# EAGLE schematic cft (EAGLE 5.11), part 2 of 7
## Sheet 12 of 49
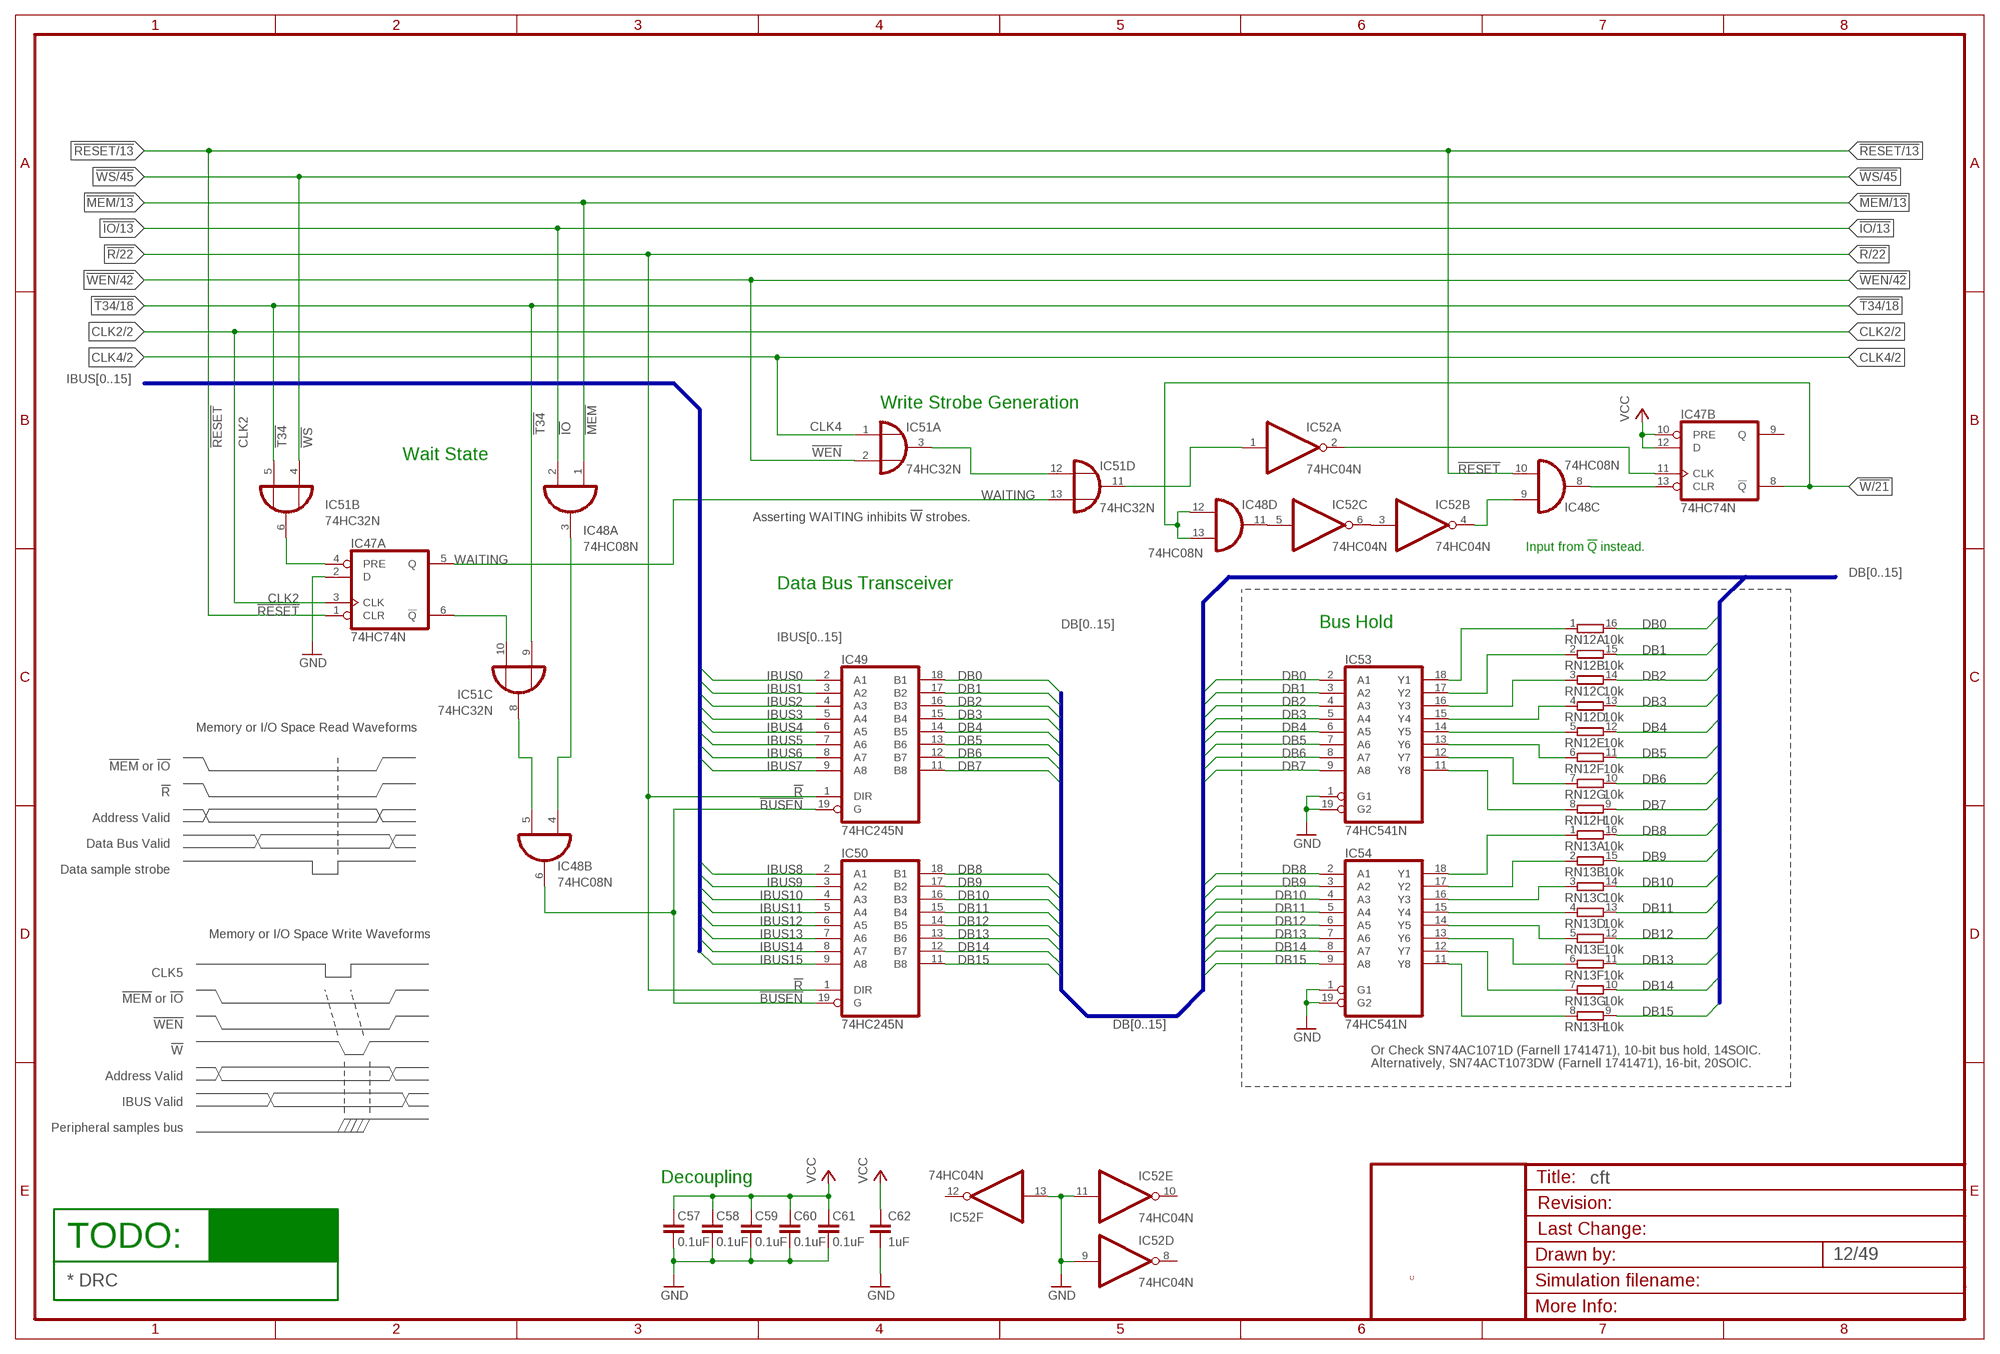
[diagram p11: schematic, sheet 12]

### Parts
C57  0.1uF  C-EU025-024X044  [C025-024X044]
C58  0.1uF  C-EU025-024X044  [C025-024X044]
C59  0.1uF  C-EU025-024X044  [C025-024X044]
C60  0.1uF  C-EU025-024X044  [C025-024X044]
C61  0.1uF  C-EU025-024X044  [C025-024X044]
C62  1uF  C-EU025-024X044  [C025-024X044]
IC47  74HC74N  [DIL14]
IC48  74HC08N  [DIL14]
IC49  74HC245N  [DIL20]
IC50  74HC245N  [DIL20]
IC51  74HC32N  [DIL14]
IC52  74HC04N  [DIL14]
IC53  74HC541N  [DIL20]
IC54  74HC541N  [DIL20]
RN12  10k  8R-N  [DIL16]
RN13  10k  8R-N  [DIL16]

### Nets
!BUSEN: IC48.6(B:O) IC49.19(G) IC50.19(G)
!EN0: IC48.3(A:O) IC48.4(B:I0)
!IO: IC48.2(A:I1) ; also sheet 4,5,6,13,42,44,45,46
!MEM: IC48.1(A:I0) ; also sheet 4,5,6,13,21,24,42,44,45,46
!R: IC49.1(DIR) IC50.1(DIR) ; also sheet 4,5,6,22,24,25,26,27,28,29,30,41,42,44,45,46,47,48
!RESET: IC47.1(A:CLR) IC48.10(C:I1) ; also sheet 2,3,4,7,8,10,11,13,14,17,18,19,20,21,22,25,26,28,29,30,31,44,45,46,47
!T34: IC51.5(B:I1) IC51.9(C:I0) ; also sheet 2,18,44,45,46
!W: IC47.8(B:!Q) IC48.12(D:I0) IC48.13(D:I1) ; also sheet 21,22,24,25,26,27,28,29,30,41,44,45,46,47,48
!WEN: IC51.2(A:I1) ; also sheet 4,5,6,42
!WS: IC51.4(B:I0) ; also sheet 4,44,45,46
CLK2: IC47.3(A:CLK) ; also sheet 2,44,45,46
CLK4: IC51.1(A:I0) ; also sheet 2,4,8,44,45,46
DB0: IC49.18(B1) IC53.2(A1) RN12.16 ; also sheet 21,22,24,25,26,27,28,29,30,31,41,44,45,46,47,48
DB1: IC49.17(B2) IC53.3(A2) RN12.15 ; also sheet 21,22,24,25,26,27,28,29,30,31,41,44,45,46,47,48
DB2: IC49.16(B3) IC53.4(A3) RN12.14 ; also sheet 21,22,24,25,26,27,28,29,30,31,41,44,45,46,47,48
DB3: IC49.15(B4) IC53.5(A4) RN12.13 ; also sheet 21,22,24,25,26,27,28,29,30,31,41,44,45,46,47,48
DB4: IC49.14(B5) IC53.6(A5) RN12.12 ; also sheet 21,22,24,25,26,27,28,29,30,31,41,44,45,46,47,48
DB5: IC49.13(B6) IC53.7(A6) RN12.11 ; also sheet 21,22,24,25,26,27,28,29,30,31,41,44,45,46,47,48
DB6: IC49.12(B7) IC53.8(A7) RN12.10 ; also sheet 21,22,24,25,26,27,28,29,30,31,41,44,45,46,47,48
DB7: IC49.11(B8) IC53.9(A8) RN12.9 ; also sheet 21,22,24,25,26,27,28,29,30,31,41,44,45,46,47,48
DB8: IC50.18(B1) IC54.2(A1) RN13.16 ; also sheet 21,24,26,27,29,30,31,41,44,45,46,48
DB9: IC50.17(B2) IC54.3(A2) RN13.15 ; also sheet 24,26,27,29,30,41,44,45,46,48
DB10: IC50.16(B3) IC54.4(A3) RN13.14 ; also sheet 24,26,27,29,30,41,44,45,46,48
DB11: IC50.15(B4) IC54.5(A4) RN13.13 ; also sheet 24,26,27,29,30,41,44,45,46,48
DB12: IC50.14(B5) IC54.6(A5) RN13.12 ; also sheet 24,26,27,29,30,41,44,45,46,48
DB13: IC50.13(B6) IC54.7(A6) RN13.11 ; also sheet 24,26,27,29,30,41,44,45,46,48
DB14: IC50.12(B7) IC54.8(A7) RN13.10 ; also sheet 24,26,27,29,30,41,44,45,46,48
DB15: IC50.11(B8) IC54.9(A8) RN13.9 ; also sheet 24,26,27,29,30,41,44,45,46,48
GND [low power]: C57.1 C58.1 C59.1 C60.1 C61.1 C62.2 IC47.2(A:D) IC52.9(D:I) IC52.11(E:I) IC52.13(F:I) IC53.1(G1) IC53.19(G2) IC54.1(G1) IC54.19(G2) ; also sheet 2,3,4,5,6,7,8,9,10,11,13,14,15,16,17,18,19,20,21,22,24,25,26,27,28,29,30,31,32,33,34,35,36,37,38,39,40,41,42,43,44,45,46,47,48,49
IBUS0: IC49.2(A1) ; also sheet 3,6,9,10,13,14,15,16,18,20
IBUS1: IC49.3(A2) ; also sheet 3,6,9,10,13,14,15,16,18,20
IBUS2: IC49.4(A3) ; also sheet 3,6,9,10,13,14,15,16,18,20
IBUS3: IC49.5(A4) ; also sheet 3,6,9,10,13,14,15,16,18,20
IBUS4: IC49.6(A5) ; also sheet 3,6,9,10,13,14,15,16,18,20
IBUS5: IC49.7(A6) ; also sheet 3,6,9,10,13,14,15,16,18,20
IBUS6: IC49.8(A7) ; also sheet 3,6,9,10,13,14,15,16,18,20
IBUS7: IC49.9(A8) ; also sheet 3,6,9,10,13,14,15,16,18,20
IBUS8: IC50.2(A1) ; also sheet 3,6,9,10,13,14,15,16,18,20
IBUS9: IC50.3(A2) ; also sheet 3,6,9,10,13,14,15,16,18,20
IBUS10: IC50.4(A3) ; also sheet 3,6,9,10,13,14,15,16,18,20
IBUS11: IC50.5(A4) ; also sheet 3,6,9,10,13,14,15,16,18,20
IBUS12: IC50.6(A5) ; also sheet 3,6,9,10,13,14,15,16,18,20
IBUS13: IC50.7(A6) ; also sheet 3,6,9,10,13,14,15,16,18,20
IBUS14: IC50.8(A7) ; also sheet 3,6,9,10,13,14,15,16,18,20
IBUS15: IC50.9(A8) ; also sheet 3,6,9,10,13,14,15,16,18,20
N$17: IC47.6(A:!Q) IC51.10(C:I1)
N$18: IC48.5(B:I1) IC51.8(C:O)
N$19: IC47.4(A:PRE) IC51.6(B:O)
N$24: IC48.9(C:I0) IC52.4(B:O)
N$25: IC47.13(B:CLR) IC48.8(C:O)
N$26: IC47.11(B:CLK) IC52.2(A:O)
N$27: IC52.3(B:I) IC52.6(C:O)
N$28: IC48.11(D:O) IC52.5(C:I)
N$34: IC51.11(D:O) IC52.1(A:I)
N$382: IC51.3(A:O) IC51.12(D:I0)
N$715: IC53.15(Y4) RN12.4
N$716: IC53.14(Y5) RN12.5
N$717: IC53.13(Y6) RN12.6
N$718: IC53.12(Y7) RN12.7
N$719: IC53.16(Y3) RN12.3
N$720: IC53.17(Y2) RN12.2
N$721: IC53.18(Y1) RN12.1
N$722: IC53.11(Y8) RN12.8
N$723: IC54.15(Y4) RN13.4
N$724: IC54.16(Y3) RN13.3
N$725: IC54.17(Y2) RN13.2
N$726: IC54.18(Y1) RN13.1
N$727: IC54.14(Y5) RN13.5
N$728: IC54.13(Y6) RN13.6
N$729: IC54.12(Y7) RN13.7
N$730: IC54.11(Y8) RN13.8
VCC [low power]: C57.2 C58.2 C59.2 C60.2 C61.2 C62.1 IC47.10(B:PRE) IC47.12(B:D) ; also sheet 2,3,4,6,7,8,9,10,11,13,14,15,16,17,18,19,20,21,22,24,25,26,27,28,29,30,31,34,35,36,37,38,39,40,41,42,43,44,45,46,47,48,49
WAITING: IC47.5(A:Q) IC51.13(D:I1)
Unconnected: IC47.9(B:Q) IC52.8(D:O) IC52.10(E:O) IC52.12(F:O)

### Buses
IBUS[0..15]
DB[0..15]

### Notes on the sheet
- Write Strobe Generation
- Wait State
- Asserting WAITING inhibits !W! strobes.
- Input from !Q! instead.
- Data Bus Transceiver
- Bus Hold
- Memory or I/O Space Read Waveforms
- !MEM! or !IO
- !R
- Address Valid
- Data Bus Valid
- Data sample strobe
- Memory or I/O Space Write Waveforms
- CLK5
- !MEM! or !IO
- !WEN
- !W | Or Check SN74AC1071D (Farnell 1741471), 10-bit bus hold, 14SOIC.
- Alternatively, SN74ACT1073DW (Farnell 1741471), 16-bit, 20SOIC.
- Address Valid
- IBUS Valid
- Peripheral samples bus
- Decoupling
- TODO:
- U
- * DRC

## Sheet 13 of 49
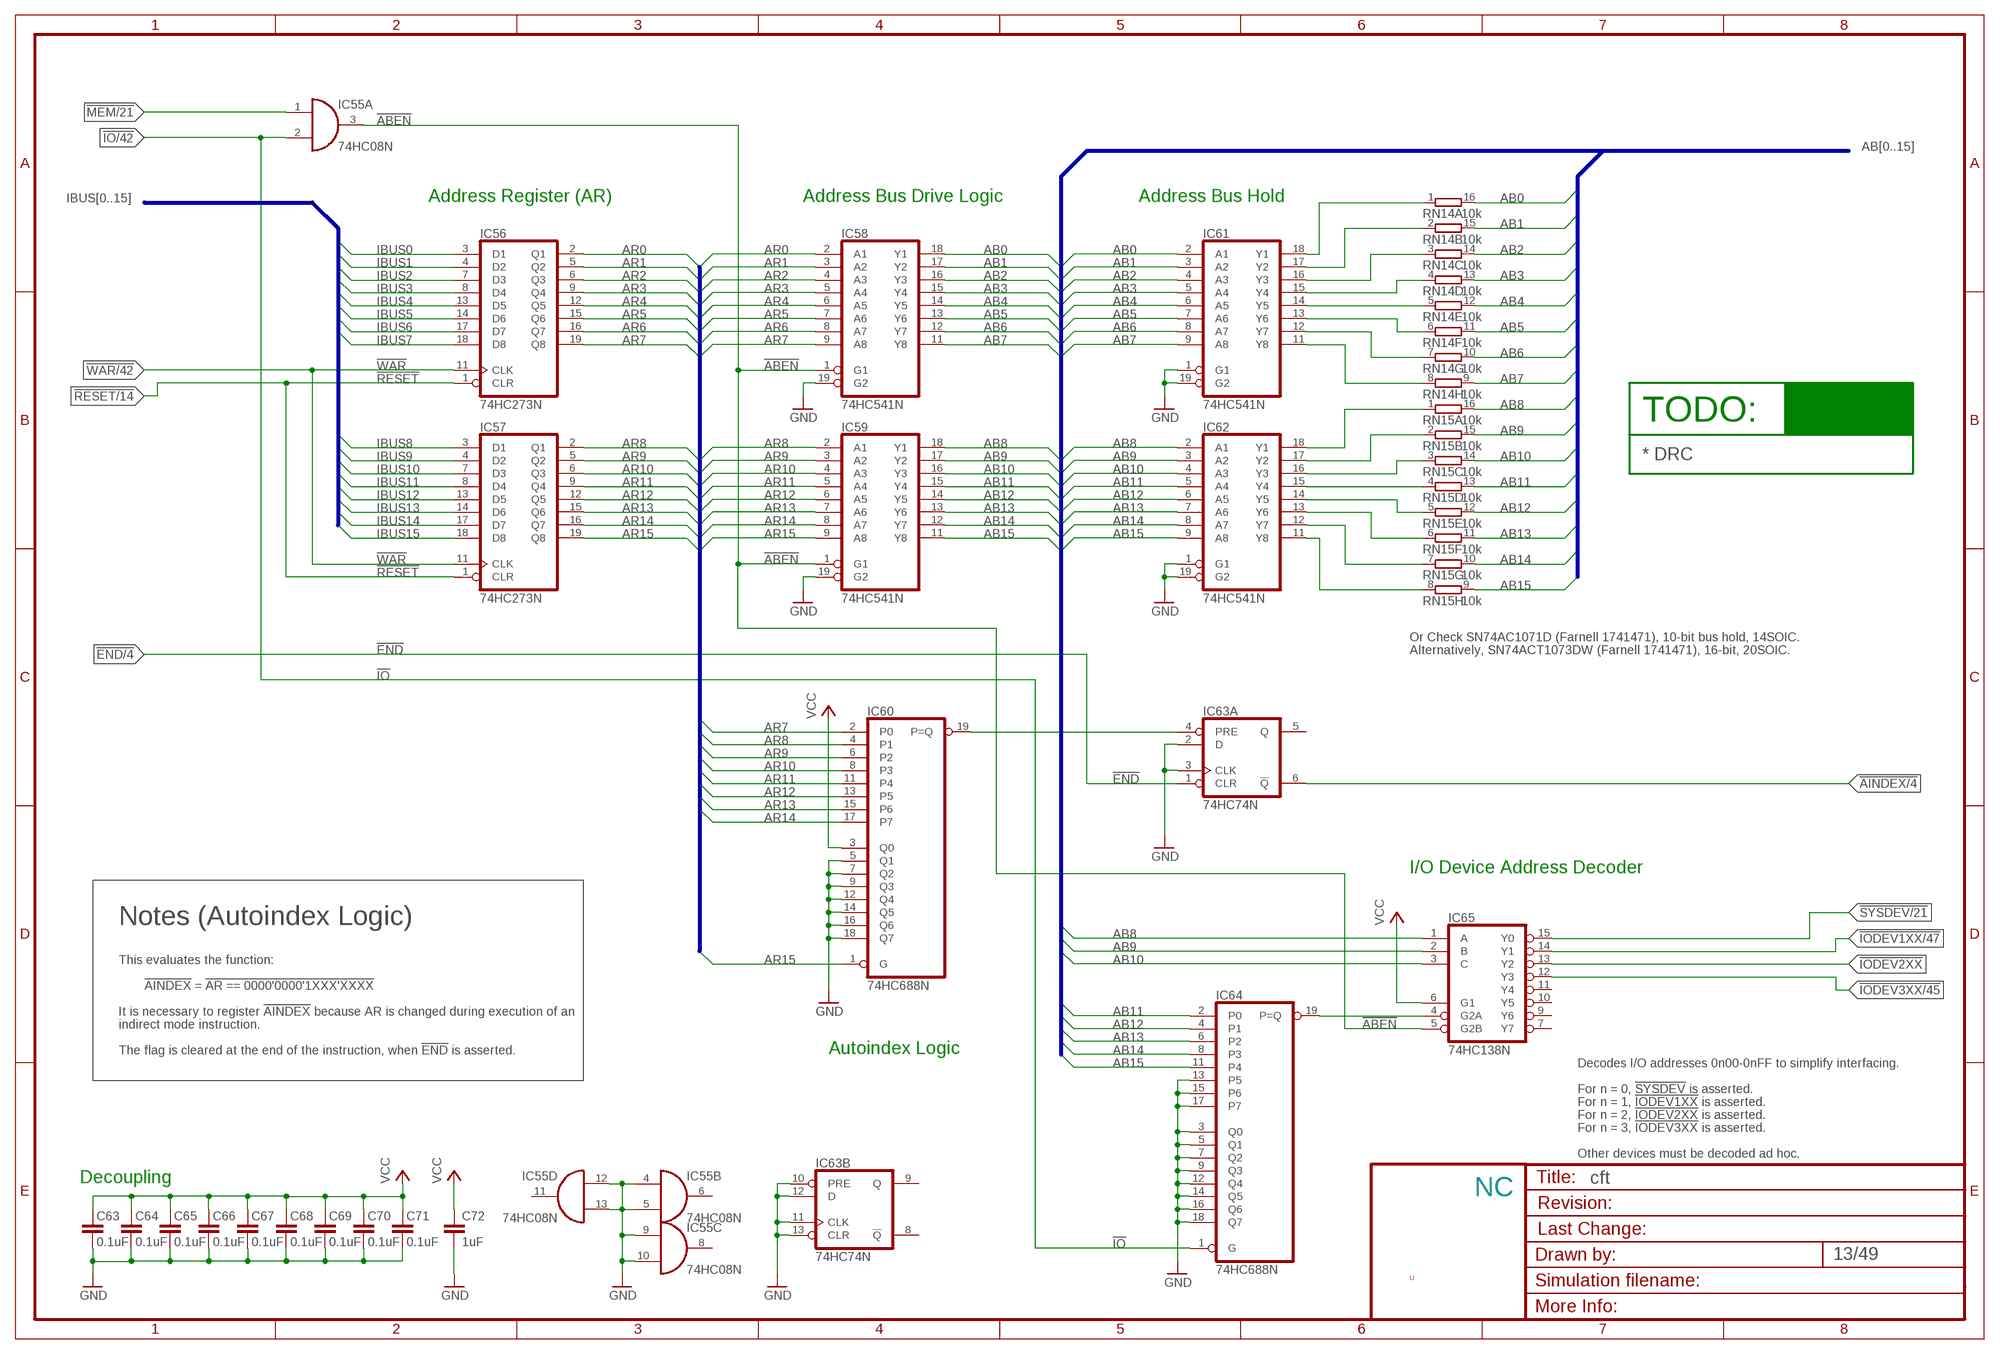
[diagram p12: schematic, sheet 13]

### Parts
C63  0.1uF  C-EU025-024X044  [C025-024X044]
C64  0.1uF  C-EU025-024X044  [C025-024X044]
C65  0.1uF  C-EU025-024X044  [C025-024X044]
C66  0.1uF  C-EU025-024X044  [C025-024X044]
C67  0.1uF  C-EU025-024X044  [C025-024X044]
C68  0.1uF  C-EU025-024X044  [C025-024X044]
C69  0.1uF  C-EU025-024X044  [C025-024X044]
C70  0.1uF  C-EU025-024X044  [C025-024X044]
C71  0.1uF  C-EU025-024X044  [C025-024X044]
C72  1uF  C-EU025-024X044  [C025-024X044]
IC55  74HC08N  [DIL14]
IC56  74HC273N  [DIL20]
IC57  74HC273N  [DIL20]
IC58  74HC541N  [DIL20]
IC59  74HC541N  [DIL20]
IC60  74HC688N  [DIL20]
IC61  74HC541N  [DIL20]
IC62  74HC541N  [DIL20]
IC63  74HC74N  [DIL14]
IC64  74HC688N  [DIL20]
IC65  74HC138N  [DIL16]
RN14  10k  8R-N  [DIL16]
RN15  10k  8R-N  [DIL16]

### Nets
!ABEN: IC55.3(A:O) IC58.1(G1) IC59.1(G1) IC65.5(G2B)
!END: IC63.1(A:CLR) ; also sheet 4,5,6,9,11
!IO: IC55.2(A:I1) IC64.1(G) ; also sheet 4,5,6,12,42,44,45,46
!IODEV1XX: IC65.14(Y1) ; also sheet 44,45,46,47,48
!IODEV2XX: IC65.13(Y2) ; also sheet 44,45,46
!IODEV3XX: IC65.12(Y3) ; also sheet 44,45,46
!MEM: IC55.1(A:I0) ; also sheet 4,5,6,12,21,24,42,44,45,46
!RESET: IC56.1(CLR) IC57.1(CLR) ; also sheet 2,3,4,7,8,10,11,12,14,17,18,19,20,21,22,25,26,28,29,30,31,44,45,46,47
!SYSDEV: IC65.15(Y0) ; also sheet 21,22,25,26,27,28,29,30,41,44,45,46
!WAR: IC56.11(CLK) IC57.11(CLK) ; also sheet 6,7,42
AB0: IC58.18(Y1) IC61.2(A1) RN14.16 ; also sheet 21,24,25,26,27,28,29,30,41,44,45,46,47,48
AB1: IC58.17(Y2) IC61.3(A2) RN14.15 ; also sheet 21,24,25,26,27,28,29,30,41,44,45,46,47,48
AB2: IC58.16(Y3) IC61.4(A3) RN14.14 ; also sheet 21,24,25,26,27,29,30,41,44,45,46,47,48
AB3: IC58.15(Y4) IC61.5(A4) RN14.13 ; also sheet 24,25,26,27,28,29,30,41,44,45,46,47,48
AB4: IC58.14(Y5) IC61.6(A5) RN14.12 ; also sheet 22,24,25,26,27,28,29,30,41,44,45,46,47,48
AB5: IC58.13(Y6) IC61.7(A6) RN14.11 ; also sheet 21,22,24,25,26,27,28,29,30,41,44,45,46,47,48
AB6: IC58.12(Y7) IC61.8(A7) RN14.10 ; also sheet 21,22,24,25,26,27,28,29,30,41,44,45,46,47,48
AB7: IC58.11(Y8) IC61.9(A8) RN14.9 ; also sheet 21,22,24,25,26,27,28,29,30,41,44,45,46,47,48
AB8: IC59.18(Y1) IC62.2(A1) IC65.1(A) RN15.16 ; also sheet 24,44,45,46
AB9: IC59.17(Y2) IC62.3(A2) IC65.2(B) RN15.15 ; also sheet 24,44,45,46
AB10: IC59.16(Y3) IC62.4(A3) IC65.3(C) RN15.14 ; also sheet 24,44,45,46
AB11: IC59.15(Y4) IC62.5(A4) IC64.2(P0) RN15.13 ; also sheet 24,44,45,46
AB12: IC59.14(Y5) IC62.6(A5) IC64.4(P1) RN15.12 ; also sheet 24,44,45,46
AB13: IC59.13(Y6) IC62.7(A6) IC64.6(P2) RN15.11 ; also sheet 21,44,45,46
AB14: IC59.12(Y7) IC62.8(A7) IC64.8(P3) RN15.10 ; also sheet 21,44,45,46
AB15: IC59.11(Y8) IC62.9(A8) IC64.11(P4) RN15.9 ; also sheet 21,44,45,46
AR0: IC56.2(Q1) IC58.2(A1)
AR1: IC56.5(Q2) IC58.3(A2)
AR2: IC56.6(Q3) IC58.4(A3)
AR3: IC56.9(Q4) IC58.5(A4)
AR4: IC56.12(Q5) IC58.6(A5)
AR5: IC56.15(Q6) IC58.7(A6)
AR6: IC56.16(Q7) IC58.8(A7)
AR7: IC56.19(Q8) IC58.9(A8) IC60.2(P0)
AR8: IC57.2(Q1) IC59.2(A1) IC60.4(P1)
AR9: IC57.5(Q2) IC59.3(A2) IC60.6(P2)
AR10: IC57.6(Q3) IC59.4(A3) IC60.8(P3)
AR11: IC57.9(Q4) IC59.5(A4) IC60.11(P4)
AR12: IC57.12(Q5) IC59.6(A5) IC60.13(P5)
AR13: IC57.15(Q6) IC59.7(A6) IC60.15(P6)
AR14: IC57.16(Q7) IC59.8(A7) IC60.17(P7)
AR15: IC57.19(Q8) IC59.9(A8) IC60.1(G)
GND [low power]: C63.1 C64.1 C65.1 C66.1 C67.1 C68.1 C69.1 C70.1 C71.1 C72.2 IC55.4(B:I0) IC55.5(B:I1) IC55.9(C:I0) IC55.10(C:I1) IC55.12(D:I0) IC55.13(D:I1) IC58.19(G2) IC59.19(G2) IC60.5(Q1) IC60.7(Q2) IC60.9(Q3) IC60.12(Q4) IC60.14(Q5) IC60.16(Q6) IC60.18(Q7) IC61.1(G1) IC61.19(G2) IC62.1(G1) IC62.19(G2) IC63.2(A:D) IC63.3(A:CLK) IC63.10(B:PRE) IC63.11(B:CLK) IC63.12(B:D) IC63.13(B:CLR) IC64.3(Q0) IC64.5(Q1) IC64.7(Q2) IC64.9(Q3) IC64.12(Q4) IC64.13(P5) IC64.14(Q5) IC64.15(P6) IC64.16(Q6) IC64.17(P7) IC64.18(Q7) ; also sheet 2,3,4,5,6,7,8,9,10,11,12,14,15,16,17,18,19,20,21,22,24,25,26,27,28,29,30,31,32,33,34,35,36,37,38,39,40,41,42,43,44,45,46,47,48,49
IBUS0: IC56.3(D1) ; also sheet 3,6,9,10,12,14,15,16,18,20
IBUS1: IC56.4(D2) ; also sheet 3,6,9,10,12,14,15,16,18,20
IBUS2: IC56.7(D3) ; also sheet 3,6,9,10,12,14,15,16,18,20
IBUS3: IC56.8(D4) ; also sheet 3,6,9,10,12,14,15,16,18,20
IBUS4: IC56.13(D5) ; also sheet 3,6,9,10,12,14,15,16,18,20
IBUS5: IC56.14(D6) ; also sheet 3,6,9,10,12,14,15,16,18,20
IBUS6: IC56.17(D7) ; also sheet 3,6,9,10,12,14,15,16,18,20
IBUS7: IC56.18(D8) ; also sheet 3,6,9,10,12,14,15,16,18,20
IBUS8: IC57.3(D1) ; also sheet 3,6,9,10,12,14,15,16,18,20
IBUS9: IC57.4(D2) ; also sheet 3,6,9,10,12,14,15,16,18,20
IBUS10: IC57.7(D3) ; also sheet 3,6,9,10,12,14,15,16,18,20
IBUS11: IC57.8(D4) ; also sheet 3,6,9,10,12,14,15,16,18,20
IBUS12: IC57.13(D5) ; also sheet 3,6,9,10,12,14,15,16,18,20
IBUS13: IC57.14(D6) ; also sheet 3,6,9,10,12,14,15,16,18,20
IBUS14: IC57.17(D7) ; also sheet 3,6,9,10,12,14,15,16,18,20
IBUS15: IC57.18(D8) ; also sheet 3,6,9,10,12,14,15,16,18,20
N$95: IC64.19(P=Q) IC65.4(G2A)
N$97: IC60.19(P=Q) IC63.4(A:PRE)
N$274: IC61.15(Y4) RN14.4
N$696: IC61.14(Y5) RN14.5
N$700: IC61.13(Y6) RN14.6
N$702: IC61.12(Y7) RN14.7
N$703: IC61.16(Y3) RN14.3
N$704: IC61.17(Y2) RN14.2
N$705: IC61.18(Y1) RN14.1
N$706: IC61.11(Y8) RN14.8
N$707: IC62.15(Y4) RN15.4
N$708: IC62.16(Y3) RN15.3
N$709: IC62.17(Y2) RN15.2
N$710: IC62.18(Y1) RN15.1
N$711: IC62.14(Y5) RN15.5
N$712: IC62.13(Y6) RN15.6
N$713: IC62.12(Y7) RN15.7
N$714: IC62.11(Y8) RN15.8
VCC [low power]: C63.2 C64.2 C65.2 C66.2 C67.2 C68.2 C69.2 C70.2 C71.2 C72.1 IC60.3(Q0) IC65.6(G1) ; also sheet 2,3,4,6,7,8,9,10,11,12,14,15,16,17,18,19,20,21,22,24,25,26,27,28,29,30,31,34,35,36,37,38,39,40,41,42,43,44,45,46,47,48,49
Unconnected: IC55.6(B:O) IC55.8(C:O) IC55.11(D:O) IC63.5(A:Q) IC63.6(A:!Q) IC63.8(B:!Q) IC63.9(B:Q) IC65.7(Y7) IC65.9(Y6) IC65.10(Y5) IC65.11(Y4)

### Buses
AR[0..15]
IBUS[0..15]
AB[0..15]

### Notes on the sheet
- Address Register (AR) | Address Bus Drive Logic | Address Bus Hold
- TODO:
- * DRC
- Or Check SN74AC1071D (Farnell 1741471), 10-bit bus hold, 14SOIC.
- Alternatively, SN74ACT1073DW (Farnell 1741471), 16-bit, 20SOIC.
- I/O Device Address Decoder
- Notes (Autoindex Logic)
- This evaluates the function:
- !AINDEX! = !AR == 0000'0000'1XXX'XXXX!
- It is necessary to register !AINDEX! because AR is changed during execution of an
- indirect mode instruction.
- The flag is cleared at the end of the instruction, when !END! is asserted. | Autoindex Logic
- Decodes I/O addresses 0n00-0nFF to simplify interfacing.
- For n = 0, !SYSDEV! is asserted.
- For n = 1, !IODEV1XX! is asserted.
- For n = 2, !IODEV2XX! is asserted.
- For n = 3, !IODEV3XX! is asserted.
- Other devices must be decoded ad hoc.
- Decoupling
- NC
- U

## Sheet 14 of 49
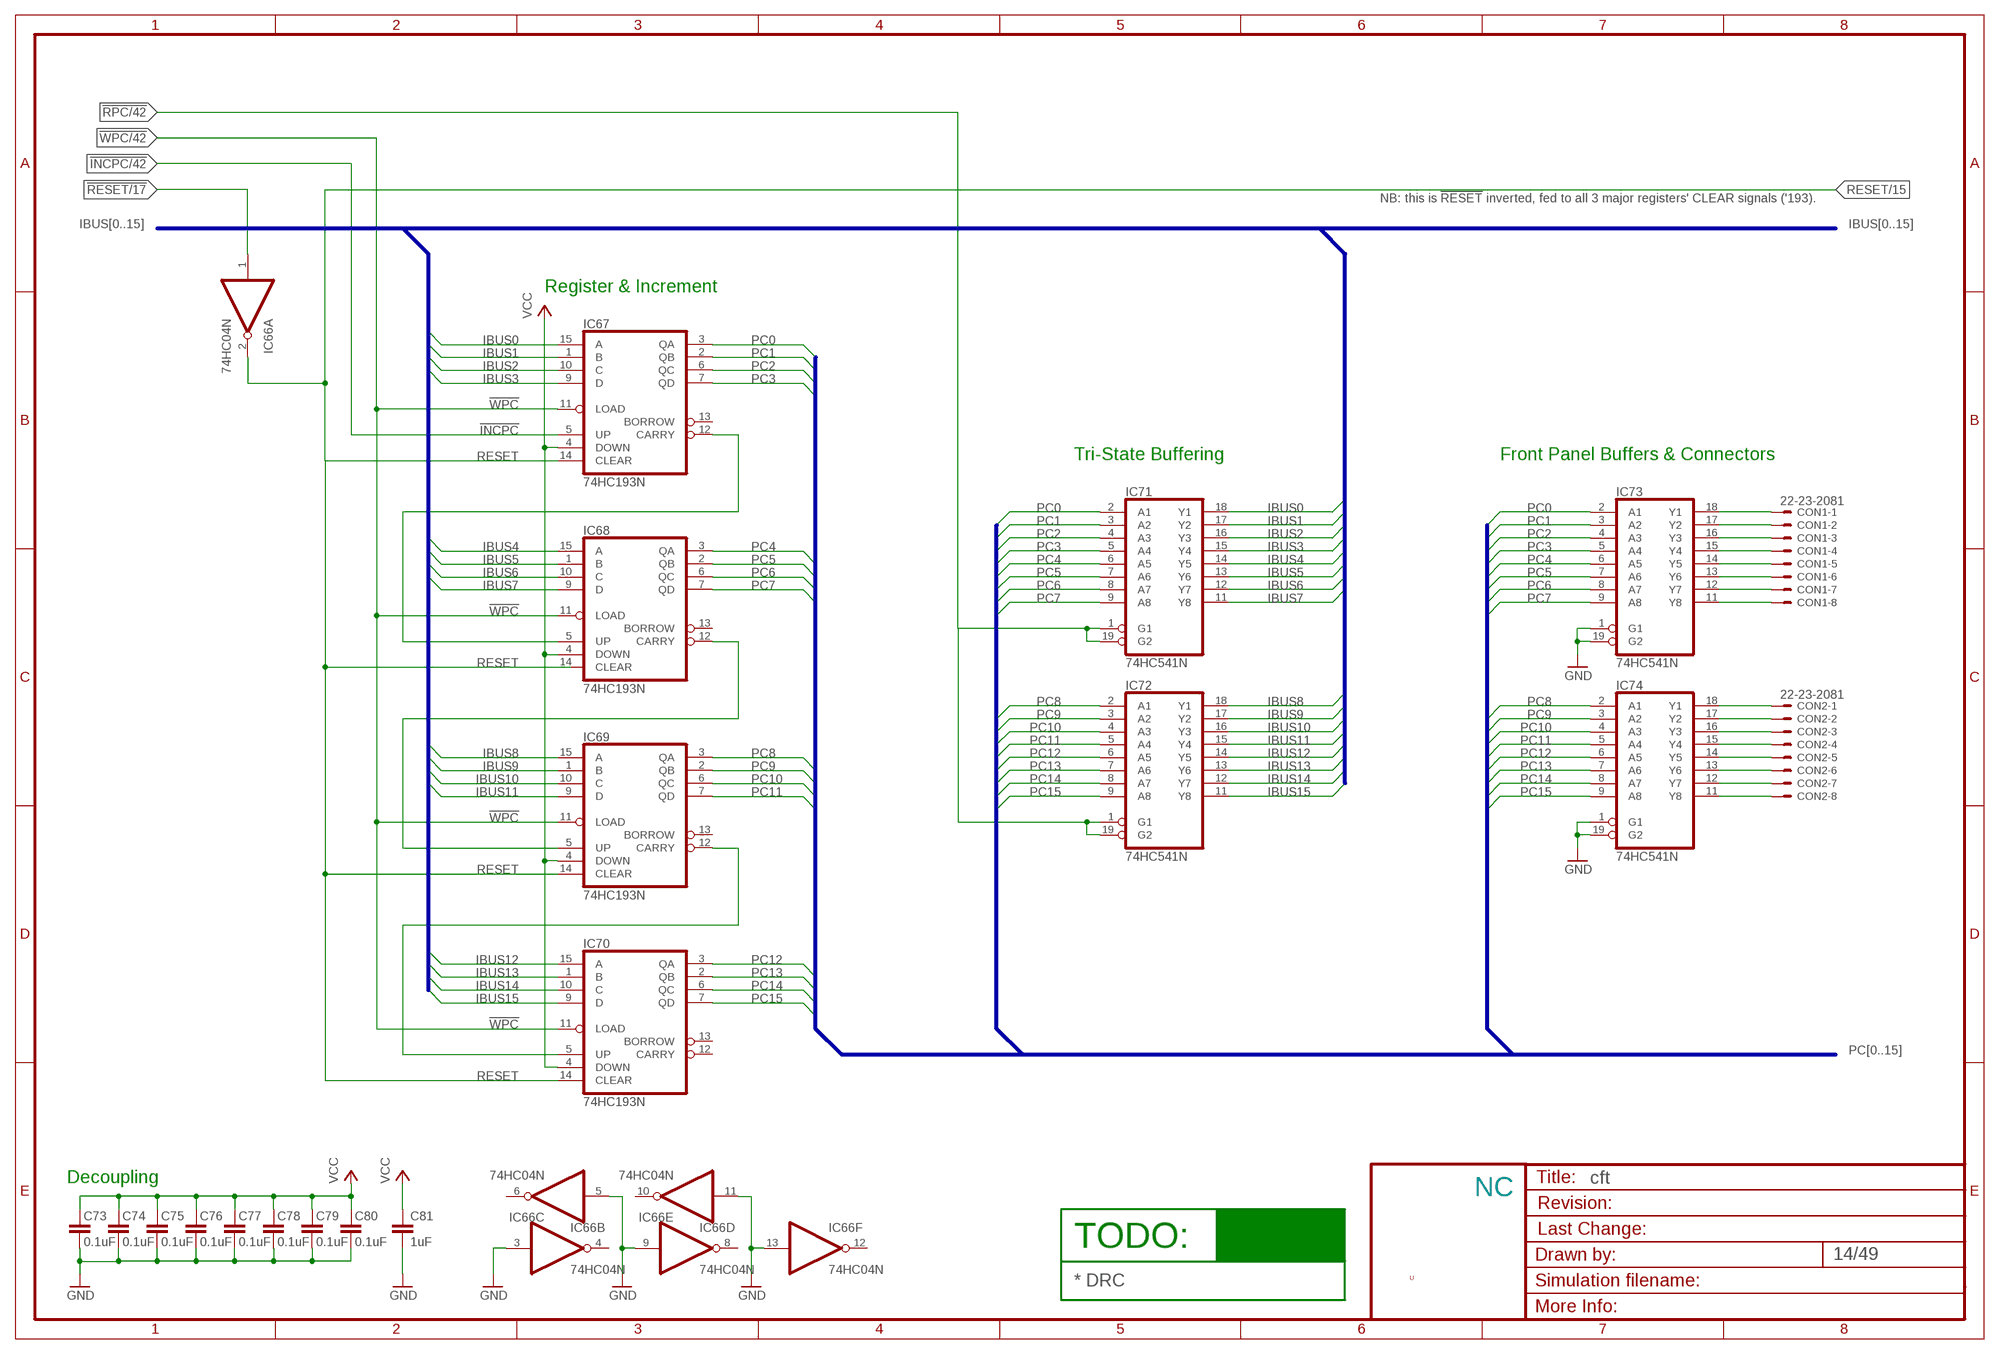
[diagram p13: schematic, sheet 14]

### Parts
C73  0.1uF  C-EU025-024X044  [C025-024X044]
C74  0.1uF  C-EU025-024X044  [C025-024X044]
C75  0.1uF  C-EU025-024X044  [C025-024X044]
C76  0.1uF  C-EU025-024X044  [C025-024X044]
C77  0.1uF  C-EU025-024X044  [C025-024X044]
C78  0.1uF  C-EU025-024X044  [C025-024X044]
C79  0.1uF  C-EU025-024X044  [C025-024X044]
C80  0.1uF  C-EU025-024X044  [C025-024X044]
C81  1uF  C-EU025-024X044  [C025-024X044]
CON1  22-23-2081  [22-23-2081]
CON2  22-23-2081  [22-23-2081]
IC66  74HC04N  [DIL14]
IC67  74HC193N  [DIL16]
IC68  74HC193N  [DIL16]
IC69  74HC193N  [DIL16]
IC70  74HC193N  [DIL16]
IC71  74HC541N  [DIL20]
IC72  74HC541N  [DIL20]
IC73  74HC541N  [DIL20]
IC74  74HC541N  [DIL20]

### Nets
!INCPC: IC67.5(UP) ; also sheet 4,5,6,42
!RESET: IC66.1(A:I) ; also sheet 2,3,4,7,8,10,11,12,13,17,18,19,20,21,22,25,26,28,29,30,31,44,45,46,47
!RPC: IC71.1(G1) IC71.19(G2) IC72.1(G1) IC72.19(G2) ; also sheet 6,7,42
!WPC: IC67.11(LOAD) IC68.11(LOAD) IC69.11(LOAD) IC70.11(LOAD) ; also sheet 6,7,42
GND [low power]: C73.1 C74.1 C75.1 C76.1 C77.1 C78.1 C79.1 C80.1 C81.2 IC66.3(B:I) IC66.5(C:I) IC66.9(D:I) IC66.11(E:I) IC66.13(F:I) IC73.1(G1) IC73.19(G2) IC74.1(G1) IC74.19(G2) ; also sheet 2,3,4,5,6,7,8,9,10,11,12,13,15,16,17,18,19,20,21,22,24,25,26,27,28,29,30,31,32,33,34,35,36,37,38,39,40,41,42,43,44,45,46,47,48,49
IBUS0: IC67.15(A) IC71.18(Y1) ; also sheet 3,6,9,10,12,13,15,16,18,20
IBUS1: IC67.1(B) IC71.17(Y2) ; also sheet 3,6,9,10,12,13,15,16,18,20
IBUS2: IC67.10(C) IC71.16(Y3) ; also sheet 3,6,9,10,12,13,15,16,18,20
IBUS3: IC67.9(D) IC71.15(Y4) ; also sheet 3,6,9,10,12,13,15,16,18,20
IBUS4: IC68.15(A) IC71.14(Y5) ; also sheet 3,6,9,10,12,13,15,16,18,20
IBUS5: IC68.1(B) IC71.13(Y6) ; also sheet 3,6,9,10,12,13,15,16,18,20
IBUS6: IC68.10(C) IC71.12(Y7) ; also sheet 3,6,9,10,12,13,15,16,18,20
IBUS7: IC68.9(D) IC71.11(Y8) ; also sheet 3,6,9,10,12,13,15,16,18,20
IBUS8: IC69.15(A) IC72.18(Y1) ; also sheet 3,6,9,10,12,13,15,16,18,20
IBUS9: IC69.1(B) IC72.17(Y2) ; also sheet 3,6,9,10,12,13,15,16,18,20
IBUS10: IC69.10(C) IC72.16(Y3) ; also sheet 3,6,9,10,12,13,15,16,18,20
IBUS11: IC69.9(D) IC72.15(Y4) ; also sheet 3,6,9,10,12,13,15,16,18,20
IBUS12: IC70.15(A) IC72.14(Y5) ; also sheet 3,6,9,10,12,13,15,16,18,20
IBUS13: IC70.1(B) IC72.13(Y6) ; also sheet 3,6,9,10,12,13,15,16,18,20
IBUS14: IC70.10(C) IC72.12(Y7) ; also sheet 3,6,9,10,12,13,15,16,18,20
IBUS15: IC70.9(D) IC72.11(Y8) ; also sheet 3,6,9,10,12,13,15,16,18,20
N$70: IC67.12(CARRY) IC68.5(UP)
N$71: IC68.12(CARRY) IC69.5(UP)
N$734: IC69.12(CARRY) IC70.5(UP)
N$736: CON1.1 IC73.18(Y1)
N$737: CON1.2 IC73.17(Y2)
N$738: CON1.3 IC73.16(Y3)
N$740: CON1.4 IC73.15(Y4)
N$741: CON1.5 IC73.14(Y5)
N$742: CON1.6 IC73.13(Y6)
N$743: CON1.7 IC73.12(Y7)
N$744: CON1.8 IC73.11(Y8)
N$745: CON2.1 IC74.18(Y1)
N$746: CON2.2 IC74.17(Y2)
N$747: CON2.3 IC74.16(Y3)
N$748: CON2.4 IC74.15(Y4)
N$749: CON2.5 IC74.14(Y5)
N$750: CON2.6 IC74.13(Y6)
N$751: CON2.7 IC74.12(Y7)
N$752: CON2.8 IC74.11(Y8)
PC0: IC67.3(QA) IC71.2(A1) IC73.2(A1) ; also sheet 32
PC1: IC67.2(QB) IC71.3(A2) IC73.3(A2) ; also sheet 32
PC2: IC67.6(QC) IC71.4(A3) IC73.4(A3) ; also sheet 32
PC3: IC67.7(QD) IC71.5(A4) IC73.5(A4) ; also sheet 32
PC4: IC68.3(QA) IC71.6(A5) IC73.6(A5) ; also sheet 32
PC5: IC68.2(QB) IC71.7(A6) IC73.7(A6) ; also sheet 32
PC6: IC68.6(QC) IC71.8(A7) IC73.8(A7) ; also sheet 32
PC7: IC68.7(QD) IC71.9(A8) IC73.9(A8) ; also sheet 32
PC8: IC69.3(QA) IC72.2(A1) IC74.2(A1) ; also sheet 32
PC9: IC69.2(QB) IC72.3(A2) IC74.3(A2) ; also sheet 32
PC10: IC69.6(QC) IC72.4(A3) IC74.4(A3) ; also sheet 6,9,32
PC11: IC69.7(QD) IC72.5(A4) IC74.5(A4) ; also sheet 6,9,32
PC12: IC70.3(QA) IC72.6(A5) IC74.6(A5) ; also sheet 6,9,32
PC13: IC70.2(QB) IC72.7(A6) IC74.7(A6) ; also sheet 6,9,32
PC14: IC70.6(QC) IC72.8(A7) IC74.8(A7) ; also sheet 6,9,32
PC15: IC70.7(QD) IC72.9(A8) IC74.9(A8) ; also sheet 6,9,32
RESET: IC66.2(A:O) IC67.14(CLEAR) IC68.14(CLEAR) IC69.14(CLEAR) IC70.14(CLEAR) ; also sheet 15,16
VCC [low power]: C73.2 C74.2 C75.2 C76.2 C77.2 C78.2 C79.2 C80.2 C81.1 IC67.4(DOWN) IC68.4(DOWN) IC69.4(DOWN) IC70.4(DOWN) ; also sheet 2,3,4,6,7,8,9,10,11,12,13,15,16,17,18,19,20,21,22,24,25,26,27,28,29,30,31,34,35,36,37,38,39,40,41,42,43,44,45,46,47,48,49
Unconnected: IC66.4(B:O) IC66.6(C:O) IC66.8(D:O) IC66.10(E:O) IC66.12(F:O) IC67.13(BORROW) IC68.13(BORROW) IC69.13(BORROW) IC70.12(CARRY) IC70.13(BORROW)

### Buses
IBUS[0..15]
PC[0..15]

### Notes on the sheet
- NB: this is !RESET! inverted, fed to all 3 major registers' CLEAR signals ('193).
- Register & Increment
- Tri-State Buffering | Front Panel Buffers & Connectors
- Decoupling
- NC
- TODO:
- U
- * DRC

## Sheet 15 of 49
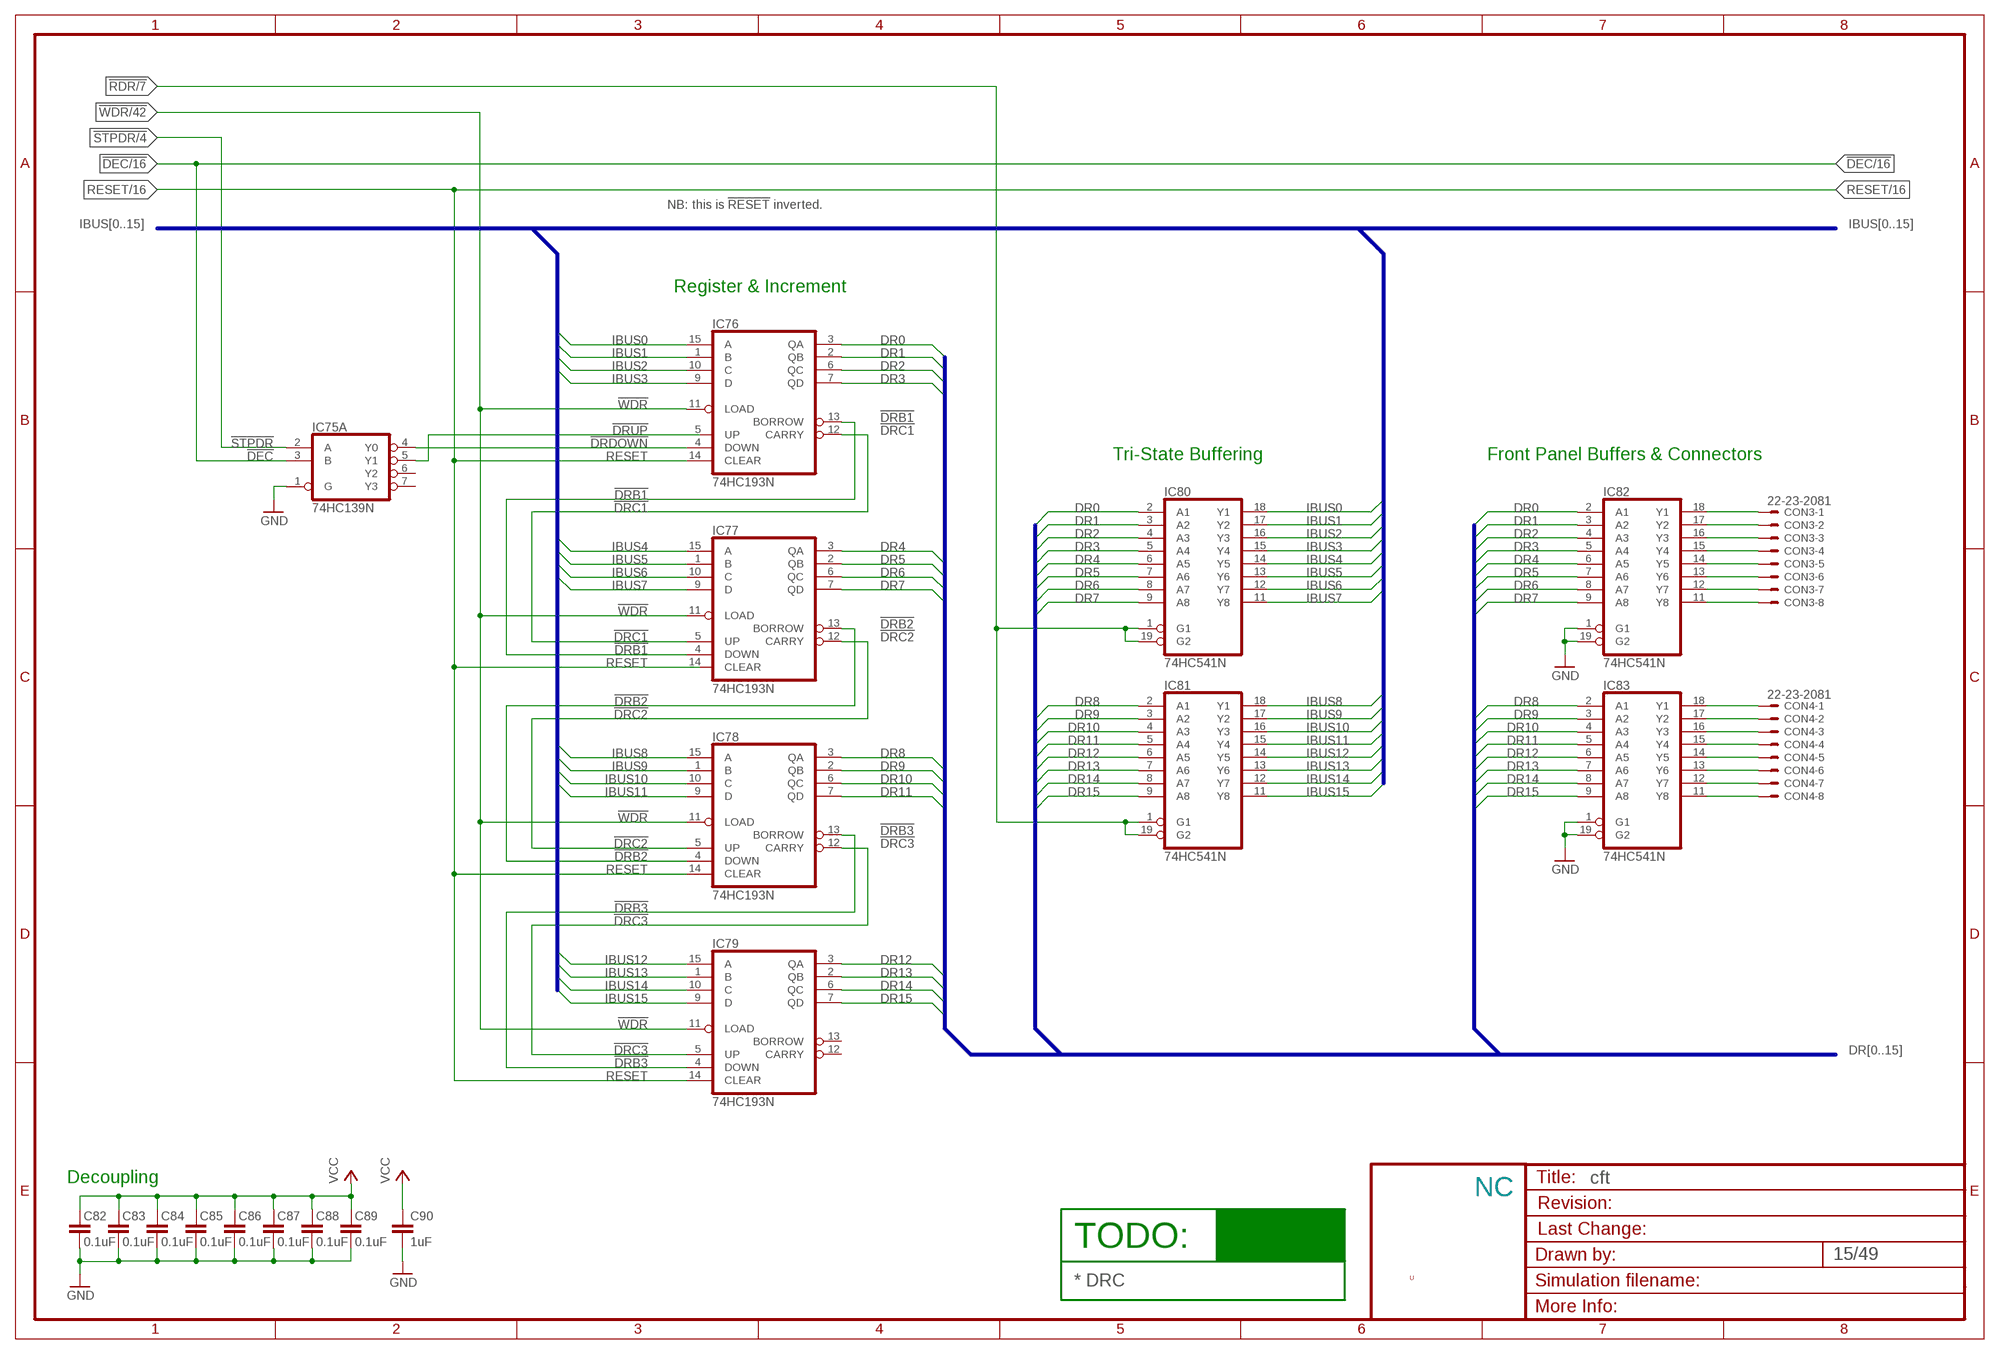
[diagram p14: schematic, sheet 15]

### Parts
C82  0.1uF  C-EU025-024X044  [C025-024X044]
C83  0.1uF  C-EU025-024X044  [C025-024X044]
C84  0.1uF  C-EU025-024X044  [C025-024X044]
C85  0.1uF  C-EU025-024X044  [C025-024X044]
C86  0.1uF  C-EU025-024X044  [C025-024X044]
C87  0.1uF  C-EU025-024X044  [C025-024X044]
C88  0.1uF  C-EU025-024X044  [C025-024X044]
C89  0.1uF  C-EU025-024X044  [C025-024X044]
C90  1uF  C-EU025-024X044  [C025-024X044]
CON3  22-23-2081  [22-23-2081]
CON4  22-23-2081  [22-23-2081]
IC75  74HC139N  [DIL16]
IC76  74HC193N  [DIL16]
IC77  74HC193N  [DIL16]
IC78  74HC193N  [DIL16]
IC79  74HC193N  [DIL16]
IC80  74HC541N  [DIL20]
IC81  74HC541N  [DIL20]
IC82  74HC541N  [DIL20]
IC83  74HC541N  [DIL20]

### Nets
!DEC: IC75.3(A:B) ; also sheet 4,5,6,16
!DRB1: IC76.13(BORROW) IC77.4(DOWN)
!DRB2: IC77.13(BORROW) IC78.4(DOWN)
!DRB3: IC78.13(BORROW) IC79.4(DOWN)
!DRC1: IC76.12(CARRY) IC77.5(UP)
!DRC2: IC77.12(CARRY) IC78.5(UP)
!DRC3: IC78.12(CARRY) IC79.5(UP)
!DRDOWN: IC75.4(A:Y0) IC76.4(DOWN)
!DRUP: IC75.5(A:Y1)
!RDR: IC80.1(G1) IC80.19(G2) IC81.1(G1) IC81.19(G2) ; also sheet 6,7
!STPDR: IC75.2(A:A) ; also sheet 4,5,6
!WDR: IC76.11(LOAD) IC77.11(LOAD) IC78.11(LOAD) IC79.11(LOAD) ; also sheet 6,7,42
DR0: IC76.3(QA) IC80.2(A1) IC82.2(A1) ; also sheet 38
DR1: IC76.2(QB) IC80.3(A2) IC82.3(A2) ; also sheet 38
DR2: IC76.6(QC) IC80.4(A3) IC82.4(A3) ; also sheet 38
DR3: IC76.7(QD) IC80.5(A4) IC82.5(A4) ; also sheet 38
DR4: IC77.3(QA) IC80.6(A5) IC82.6(A5) ; also sheet 38
DR5: IC77.2(QB) IC80.7(A6) IC82.7(A6) ; also sheet 38
DR6: IC77.6(QC) IC80.8(A7) IC82.8(A7) ; also sheet 38
DR7: IC77.7(QD) IC80.9(A8) IC82.9(A8) ; also sheet 38
DR8: IC78.3(QA) IC81.2(A1) IC83.2(A1) ; also sheet 38
DR9: IC78.2(QB) IC81.3(A2) IC83.3(A2) ; also sheet 38
DR10: IC78.6(QC) IC81.4(A3) IC83.4(A3) ; also sheet 38
DR11: IC78.7(QD) IC81.5(A4) IC83.5(A4) ; also sheet 38
DR12: IC79.3(QA) IC81.6(A5) IC83.6(A5) ; also sheet 38
DR13: IC79.2(QB) IC81.7(A6) IC83.7(A6) ; also sheet 38
DR14: IC79.6(QC) IC81.8(A7) IC83.8(A7) ; also sheet 38
DR15: IC79.7(QD) IC81.9(A8) IC83.9(A8) ; also sheet 38
GND [low power]: C82.1 C83.1 C84.1 C85.1 C86.1 C87.1 C88.1 C89.1 C90.2 IC75.1(A:G) IC82.1(G1) IC82.19(G2) IC83.1(G1) IC83.19(G2) ; also sheet 2,3,4,5,6,7,8,9,10,11,12,13,14,16,17,18,19,20,21,22,24,25,26,27,28,29,30,31,32,33,34,35,36,37,38,39,40,41,42,43,44,45,46,47,48,49
IBUS0: IC76.15(A) IC80.18(Y1) ; also sheet 3,6,9,10,12,13,14,16,18,20
IBUS1: IC76.1(B) IC80.17(Y2) ; also sheet 3,6,9,10,12,13,14,16,18,20
IBUS2: IC76.10(C) IC80.16(Y3) ; also sheet 3,6,9,10,12,13,14,16,18,20
IBUS3: IC76.9(D) IC80.15(Y4) ; also sheet 3,6,9,10,12,13,14,16,18,20
IBUS4: IC77.15(A) IC80.14(Y5) ; also sheet 3,6,9,10,12,13,14,16,18,20
IBUS5: IC77.1(B) IC80.13(Y6) ; also sheet 3,6,9,10,12,13,14,16,18,20
IBUS6: IC77.10(C) IC80.12(Y7) ; also sheet 3,6,9,10,12,13,14,16,18,20
IBUS7: IC77.9(D) IC80.11(Y8) ; also sheet 3,6,9,10,12,13,14,16,18,20
IBUS8: IC78.15(A) IC81.18(Y1) ; also sheet 3,6,9,10,12,13,14,16,18,20
IBUS9: IC78.1(B) IC81.17(Y2) ; also sheet 3,6,9,10,12,13,14,16,18,20
IBUS10: IC78.10(C) IC81.16(Y3) ; also sheet 3,6,9,10,12,13,14,16,18,20
IBUS11: IC78.9(D) IC81.15(Y4) ; also sheet 3,6,9,10,12,13,14,16,18,20
IBUS12: IC79.15(A) IC81.14(Y5) ; also sheet 3,6,9,10,12,13,14,16,18,20
IBUS13: IC79.1(B) IC81.13(Y6) ; also sheet 3,6,9,10,12,13,14,16,18,20
IBUS14: IC79.10(C) IC81.12(Y7) ; also sheet 3,6,9,10,12,13,14,16,18,20
IBUS15: IC79.9(D) IC81.11(Y8) ; also sheet 3,6,9,10,12,13,14,16,18,20
N$753: CON3.1 IC82.18(Y1)
N$754: CON3.2 IC82.17(Y2)
N$755: CON3.3 IC82.16(Y3)
N$756: CON3.4 IC82.15(Y4)
N$757: CON3.5 IC82.14(Y5)
N$758: CON3.6 IC82.13(Y6)
N$759: CON3.7 IC82.12(Y7)
N$760: CON3.8 IC82.11(Y8)
N$761: CON4.1 IC83.18(Y1)
N$762: CON4.2 IC83.17(Y2)
N$763: CON4.3 IC83.16(Y3)
N$764: CON4.4 IC83.15(Y4)
N$765: CON4.5 IC83.14(Y5)
N$766: CON4.6 IC83.13(Y6)
N$767: CON4.7 IC83.12(Y7)
N$768: CON4.8 IC83.11(Y8)
RESET: IC76.14(CLEAR) IC77.14(CLEAR) IC78.14(CLEAR) IC79.14(CLEAR) ; also sheet 14,16
VCC [low power]: C82.2 C83.2 C84.2 C85.2 C86.2 C87.2 C88.2 C89.2 C90.1 ; also sheet 2,3,4,6,7,8,9,10,11,12,13,14,16,17,18,19,20,21,22,24,25,26,27,28,29,30,31,34,35,36,37,38,39,40,41,42,43,44,45,46,47,48,49
Unconnected: IC75.6(A:Y2) IC75.7(A:Y3) IC76.5(UP) IC79.12(CARRY) IC79.13(BORROW)

### Buses
IBUS[0..15]
DR[0..15]

### Notes on the sheet
- NB: this is !RESET! inverted.
- Register & Increment
- Tri-State Buffering | Front Panel Buffers & Connectors
- Decoupling
- NC
- TODO:
- U
- * DRC

## Sheet 16 of 49
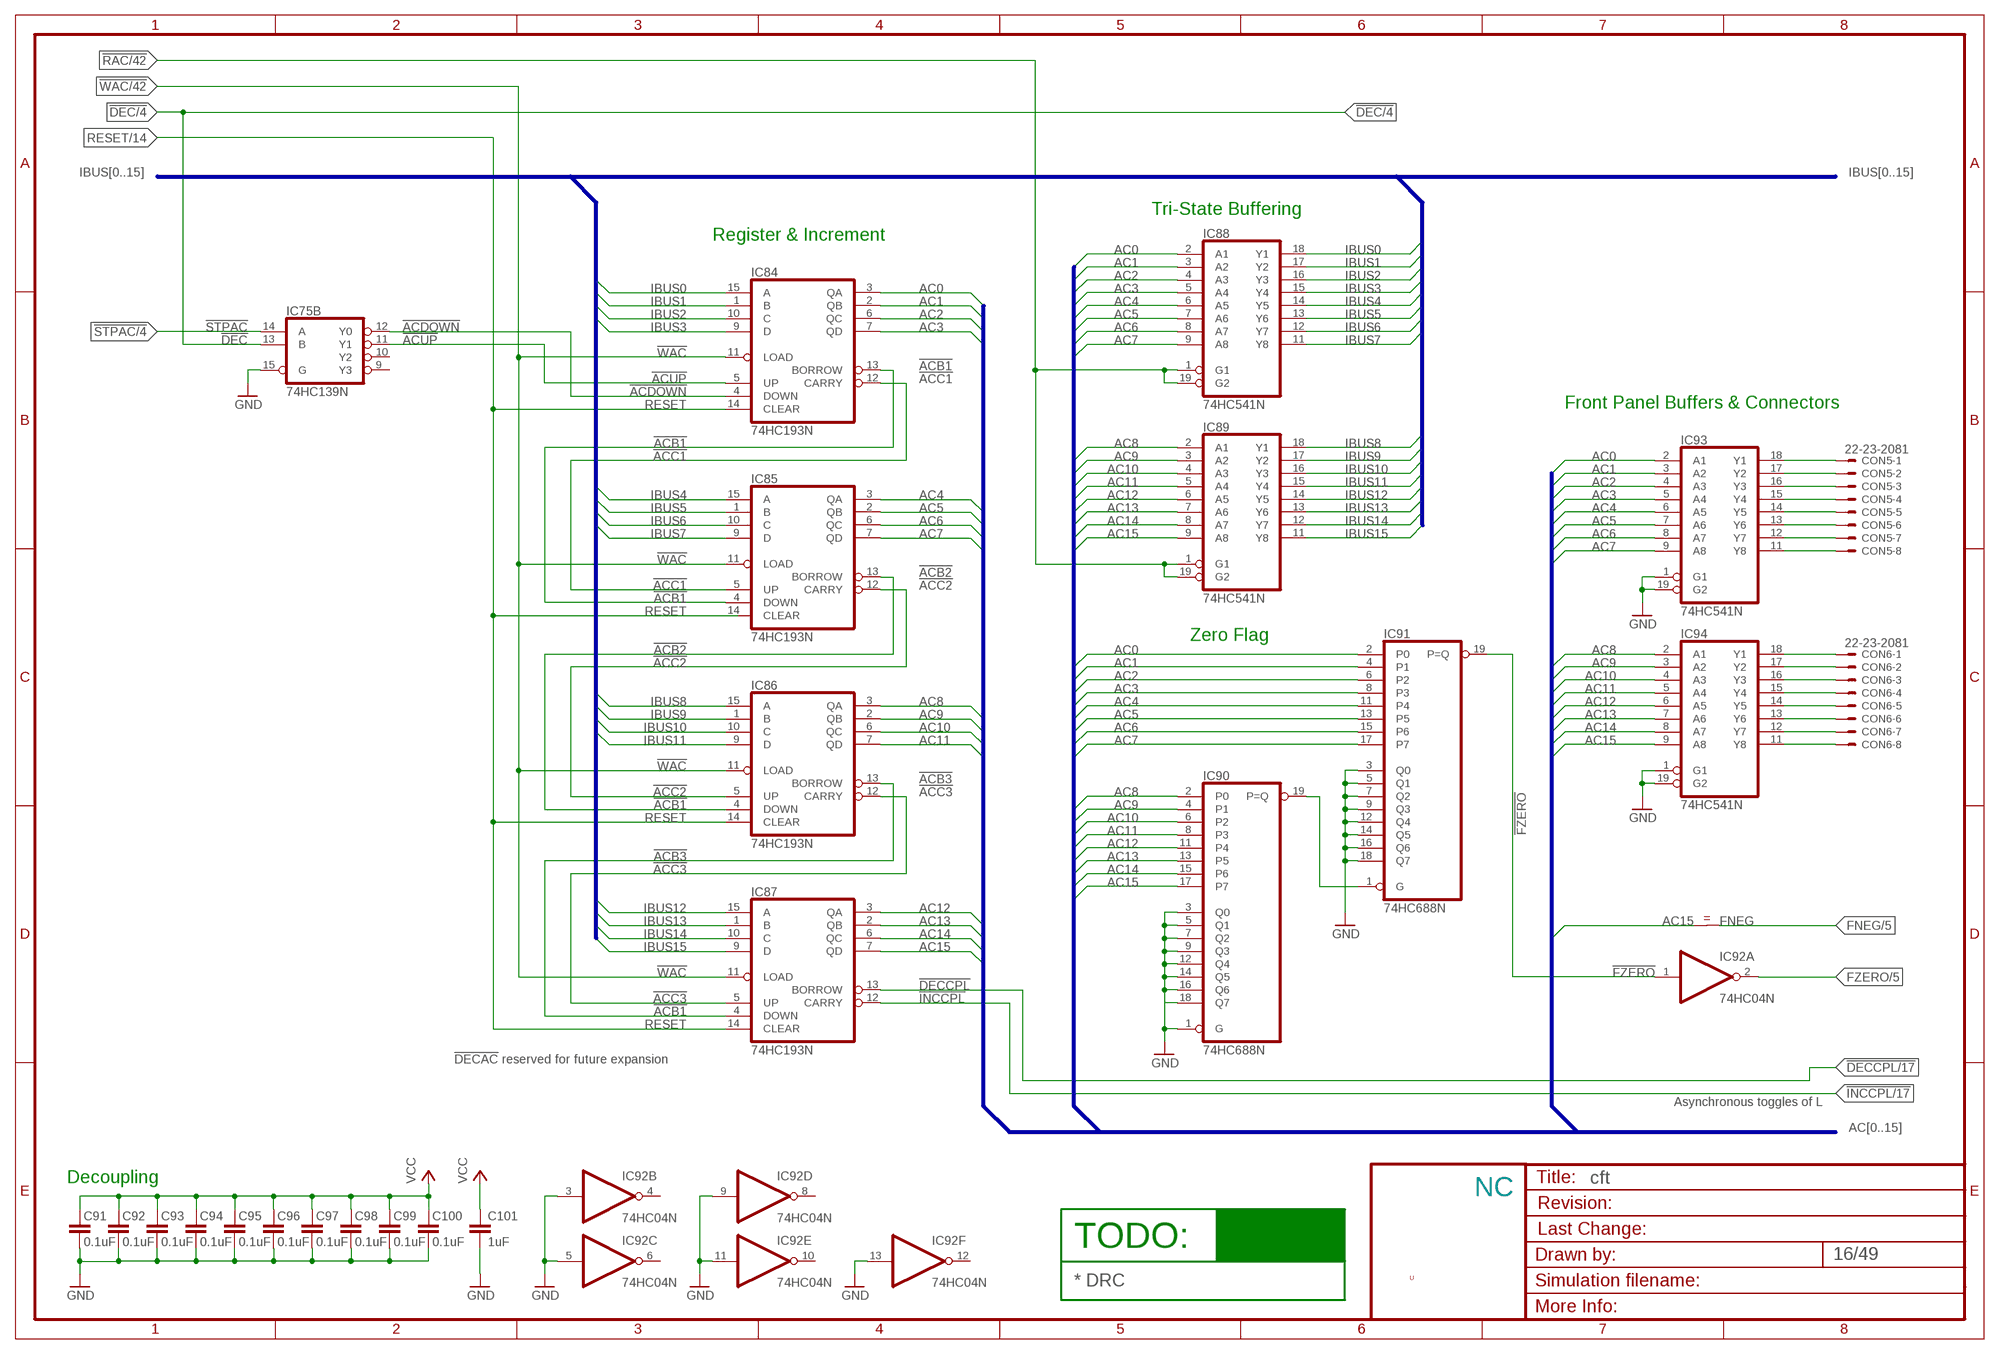
[diagram p15: schematic, sheet 16]

### Parts
C91  0.1uF  C-EU025-024X044  [C025-024X044]
C92  0.1uF  C-EU025-024X044  [C025-024X044]
C93  0.1uF  C-EU025-024X044  [C025-024X044]
C94  0.1uF  C-EU025-024X044  [C025-024X044]
C95  0.1uF  C-EU025-024X044  [C025-024X044]
C96  0.1uF  C-EU025-024X044  [C025-024X044]
C97  0.1uF  C-EU025-024X044  [C025-024X044]
C98  0.1uF  C-EU025-024X044  [C025-024X044]
C99  0.1uF  C-EU025-024X044  [C025-024X044]
C100  0.1uF  C-EU025-024X044  [C025-024X044]
C101  1uF  C-EU025-024X044  [C025-024X044]
CON5  22-23-2081  [22-23-2081]
CON6  22-23-2081  [22-23-2081]
IC84  74HC193N  [DIL16]
IC85  74HC193N  [DIL16]
IC86  74HC193N  [DIL16]
IC87  74HC193N  [DIL16]
IC88  74HC541N  [DIL20]
IC89  74HC541N  [DIL20]
IC90  74HC688N  [DIL20]
IC91  74HC688N  [DIL20]
IC92  74HC04N  [DIL14]
IC93  74HC541N  [DIL20]
IC94  74HC541N  [DIL20]
X1  SIGNAL-RENAME  [SIGNAL-RENAME]

### Nets
!ACB1: IC84.13(BORROW) IC85.4(DOWN)
!ACB2: IC85.13(BORROW) IC86.4(DOWN)
!ACB3: IC86.13(BORROW) IC87.4(DOWN)
!ACC1: IC84.12(CARRY) IC85.5(UP)
!ACC2: IC85.12(CARRY) IC86.5(UP)
!ACC3: IC86.12(CARRY) IC87.5(UP)
!ACDOWN: IC75.12(B:Y0) IC84.4(DOWN)
!ACUP: IC75.11(B:Y1) IC84.5(UP)
!DEC: IC75.13(B:B) ; also sheet 4,5,6,15
!DECCPL: IC87.13(BORROW) ; also sheet 17
!FZERO: IC91.19(P=Q) IC92.1(A:I)
!INCCPL: IC87.12(CARRY) ; also sheet 17
!RAC: IC88.1(G1) IC88.19(G2) IC89.1(G1) IC89.19(G2) ; also sheet 6,7,42
!STPAC: IC75.14(B:A) ; also sheet 4,5,6
!WAC: IC84.11(LOAD) IC85.11(LOAD) IC86.11(LOAD) IC87.11(LOAD) ; also sheet 6,7,42
AC0: IC84.3(QA) IC88.2(A1) IC91.2(P0) IC93.2(A1) ; also sheet 19,20,32
AC1: IC84.2(QB) IC88.3(A2) IC91.4(P1) IC93.3(A2) ; also sheet 19,20,32
AC2: IC84.6(QC) IC88.4(A3) IC91.6(P2) IC93.4(A3) ; also sheet 19,20,32
AC3: IC84.7(QD) IC88.5(A4) IC91.8(P3) IC93.5(A4) ; also sheet 19,20,32
AC4: IC85.3(QA) IC88.6(A5) IC91.11(P4) IC93.6(A5) ; also sheet 19,20,32
AC5: IC85.2(QB) IC88.7(A6) IC91.13(P5) IC93.7(A6) ; also sheet 19,20,32
AC6: IC85.6(QC) IC88.8(A7) IC91.15(P6) IC93.8(A7) ; also sheet 19,20,32
AC7: IC85.7(QD) IC88.9(A8) IC91.17(P7) IC93.9(A8) ; also sheet 19,20,32
AC8: IC86.3(QA) IC89.2(A1) IC90.2(P0) IC94.2(A1) ; also sheet 19,20,32
AC9: IC86.2(QB) IC89.3(A2) IC90.4(P1) IC94.3(A2) ; also sheet 19,20,32
AC10: IC86.6(QC) IC89.4(A3) IC90.6(P2) IC94.4(A3) ; also sheet 19,20,32
AC11: IC86.7(QD) IC89.5(A4) IC90.8(P3) IC94.5(A4) ; also sheet 19,20,32
AC12: IC87.3(QA) IC89.6(A5) IC90.11(P4) IC94.6(A5) ; also sheet 19,20,32
AC13: IC87.2(QB) IC89.7(A6) IC90.13(P5) IC94.7(A6) ; also sheet 19,20,32
AC14: IC87.6(QC) IC89.8(A7) IC90.15(P6) IC94.8(A7) ; also sheet 19,20,32
AC15: IC87.7(QD) IC89.9(A8) IC90.17(P7) IC94.9(A8) X1.P$1 ; also sheet 19,20,32
FNEG: X1.P$2 ; also sheet 5,6,8,40
FZERO: IC92.2(A:O) ; also sheet 5,6,8,40
GND [low power]: C91.1 C92.1 C93.1 C94.1 C95.1 C96.1 C97.1 C98.1 C99.1 C100.1 C101.2 IC75.15(B:G) IC90.1(G) IC90.3(Q0) IC90.5(Q1) IC90.7(Q2) IC90.9(Q3) IC90.12(Q4) IC90.14(Q5) IC90.16(Q6) IC90.18(Q7) IC91.3(Q0) IC91.5(Q1) IC91.7(Q2) IC91.9(Q3) IC91.12(Q4) IC91.14(Q5) IC91.16(Q6) IC91.18(Q7) IC92.3(B:I) IC92.5(C:I) IC92.9(D:I) IC92.11(E:I) IC92.13(F:I) IC93.1(G1) IC93.19(G2) IC94.1(G1) IC94.19(G2) ; also sheet 2,3,4,5,6,7,8,9,10,11,12,13,14,15,17,18,19,20,21,22,24,25,26,27,28,29,30,31,32,33,34,35,36,37,38,39,40,41,42,43,44,45,46,47,48,49
IBUS0: IC84.15(A) IC88.18(Y1) ; also sheet 3,6,9,10,12,13,14,15,18,20
IBUS1: IC84.1(B) IC88.17(Y2) ; also sheet 3,6,9,10,12,13,14,15,18,20
IBUS2: IC84.10(C) IC88.16(Y3) ; also sheet 3,6,9,10,12,13,14,15,18,20
IBUS3: IC84.9(D) IC88.15(Y4) ; also sheet 3,6,9,10,12,13,14,15,18,20
IBUS4: IC85.15(A) IC88.14(Y5) ; also sheet 3,6,9,10,12,13,14,15,18,20
IBUS5: IC85.1(B) IC88.13(Y6) ; also sheet 3,6,9,10,12,13,14,15,18,20
IBUS6: IC85.10(C) IC88.12(Y7) ; also sheet 3,6,9,10,12,13,14,15,18,20
IBUS7: IC85.9(D) IC88.11(Y8) ; also sheet 3,6,9,10,12,13,14,15,18,20
IBUS8: IC86.15(A) IC89.18(Y1) ; also sheet 3,6,9,10,12,13,14,15,18,20
IBUS9: IC86.1(B) IC89.17(Y2) ; also sheet 3,6,9,10,12,13,14,15,18,20
IBUS10: IC86.10(C) IC89.16(Y3) ; also sheet 3,6,9,10,12,13,14,15,18,20
IBUS11: IC86.9(D) IC89.15(Y4) ; also sheet 3,6,9,10,12,13,14,15,18,20
IBUS12: IC87.15(A) IC89.14(Y5) ; also sheet 3,6,9,10,12,13,14,15,18,20
IBUS13: IC87.1(B) IC89.13(Y6) ; also sheet 3,6,9,10,12,13,14,15,18,20
IBUS14: IC87.10(C) IC89.12(Y7) ; also sheet 3,6,9,10,12,13,14,15,18,20
IBUS15: IC87.9(D) IC89.11(Y8) ; also sheet 3,6,9,10,12,13,14,15,18,20
N$773: CON5.1 IC93.18(Y1)
N$775: CON5.2 IC93.17(Y2)
N$776: CON5.3 IC93.16(Y3)
N$777: CON5.4 IC93.15(Y4)
N$778: CON5.5 IC93.14(Y5)
N$779: CON5.6 IC93.13(Y6)
N$780: CON5.7 IC93.12(Y7)
N$781: CON5.8 IC93.11(Y8)
N$782: CON6.1 IC94.18(Y1)
N$783: CON6.2 IC94.17(Y2)
N$784: CON6.3 IC94.16(Y3)
N$785: CON6.4 IC94.15(Y4)
N$786: CON6.5 IC94.14(Y5)
N$787: CON6.6 IC94.13(Y6)
N$788: CON6.7 IC94.12(Y7)
N$789: CON6.8 IC94.11(Y8)
N$793: IC90.19(P=Q) IC91.1(G)
RESET: IC84.14(CLEAR) IC85.14(CLEAR) IC86.14(CLEAR) IC87.14(CLEAR) ; also sheet 14,15
VCC [low power]: C91.2 C92.2 C93.2 C94.2 C95.2 C96.2 C97.2 C98.2 C99.2 C100.2 C101.1 ; also sheet 2,3,4,6,7,8,9,10,11,12,13,14,15,17,18,19,20,21,22,24,25,26,27,28,29,30,31,34,35,36,37,38,39,40,41,42,43,44,45,46,47,48,49
Unconnected: IC75.9(B:Y3) IC75.10(B:Y2) IC92.4(B:O) IC92.6(C:O) IC92.8(D:O) IC92.10(E:O) IC92.12(F:O)

### Buses
IBUS[0..15]
AC[0..15]

### Notes on the sheet
- Tri-State Buffering
- Register & Increment
- Front Panel Buffers & Connectors
- Zero Flag
- !DECAC! reserved for future expansion
- Asynchronous toggles of L
- Decoupling
- NC
- TODO:
- U
- * DRC

## Sheet 17 of 49
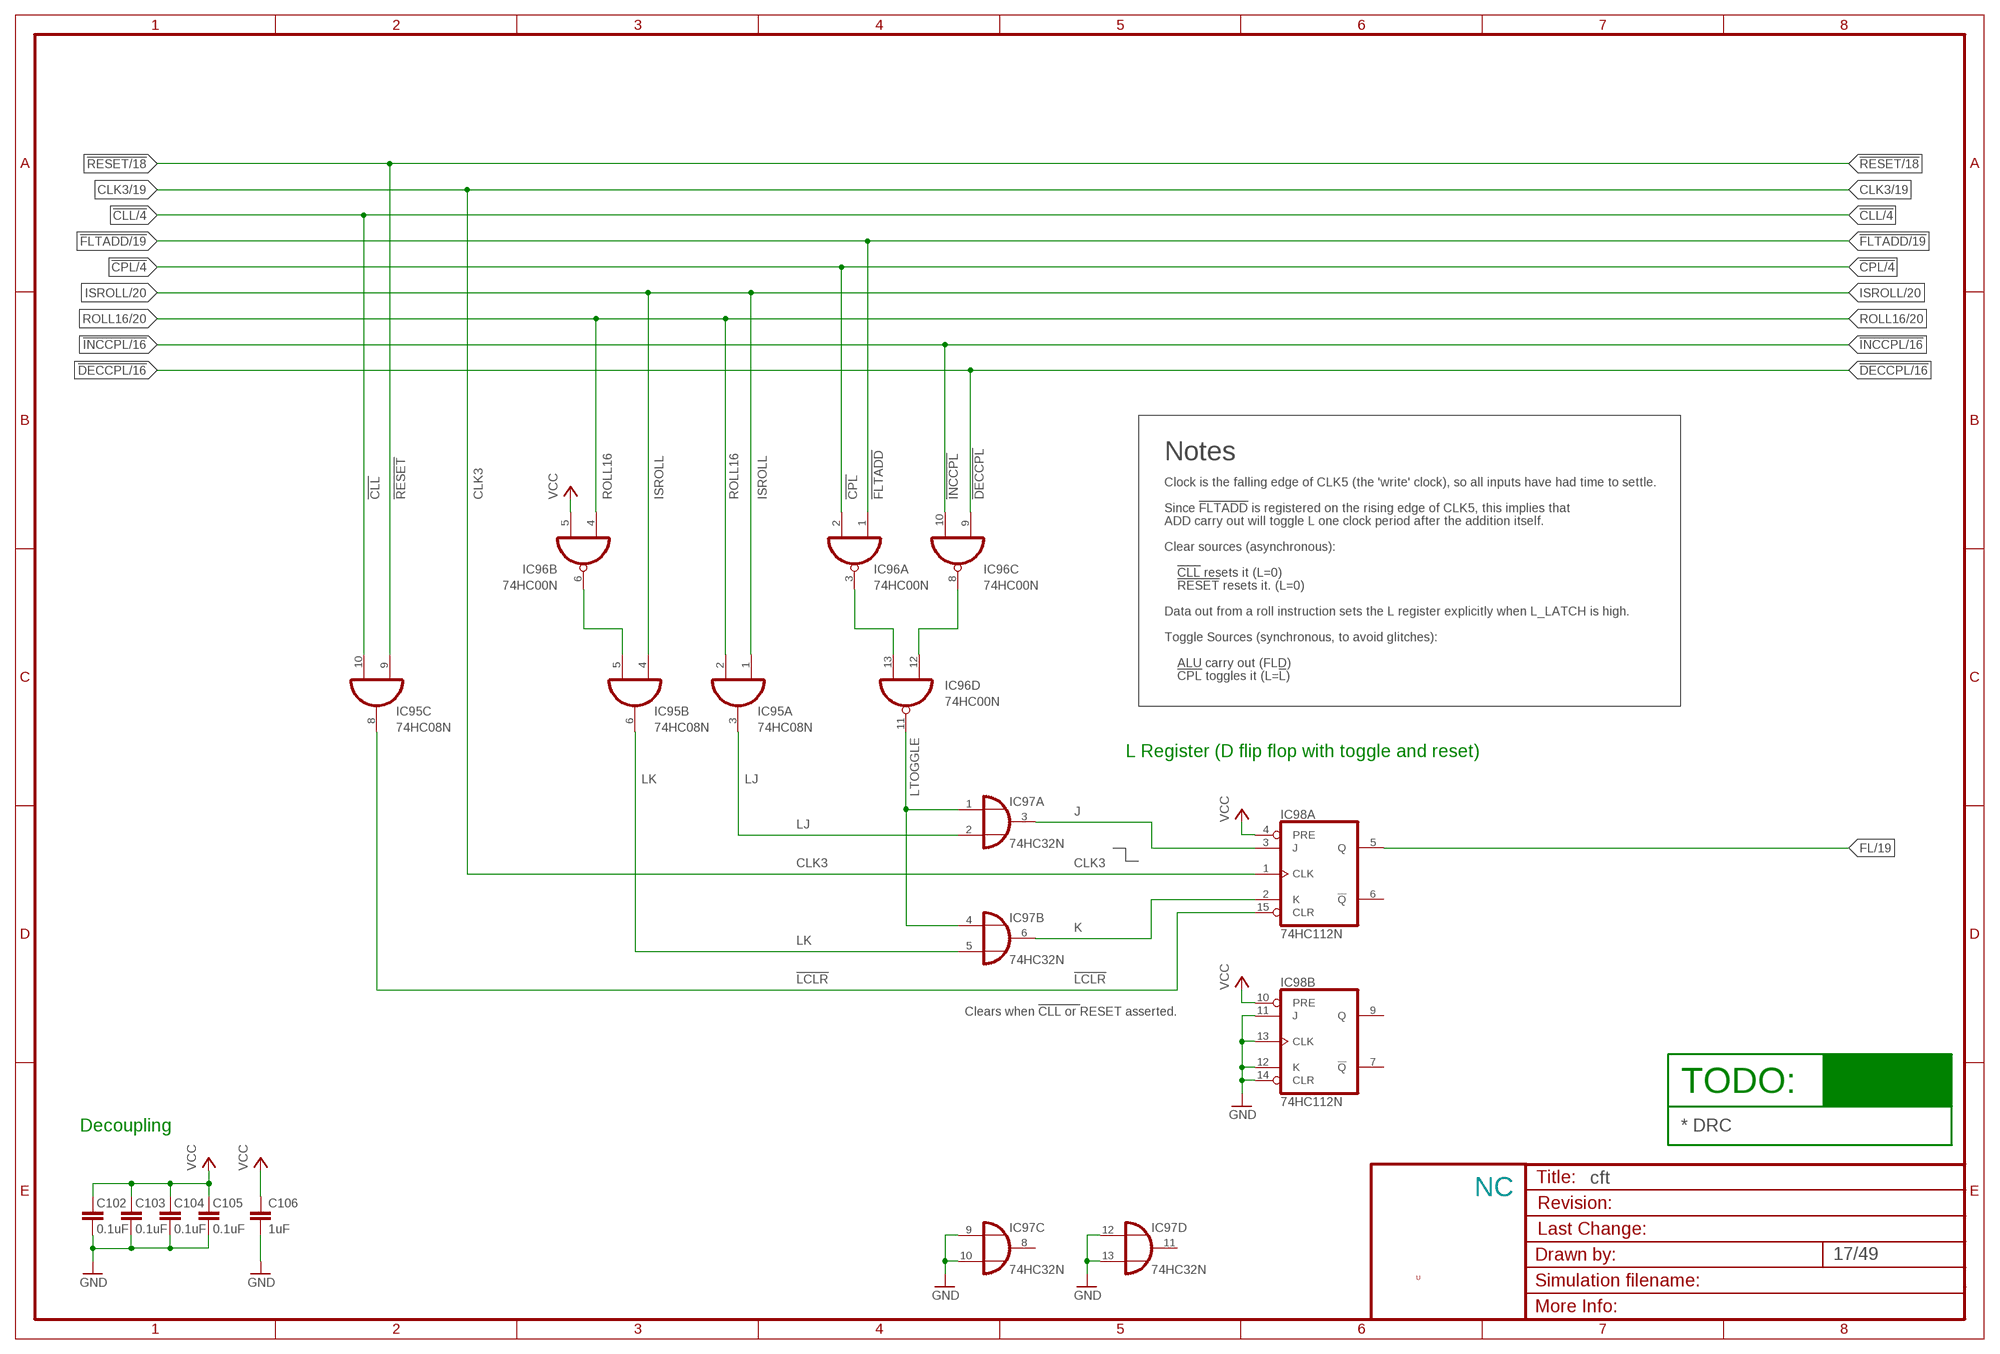
[diagram p16: schematic, sheet 17]

### Parts
C102  0.1uF  C-EU025-024X044  [C025-024X044]
C103  0.1uF  C-EU025-024X044  [C025-024X044]
C104  0.1uF  C-EU025-024X044  [C025-024X044]
C105  0.1uF  C-EU025-024X044  [C025-024X044]
C106  1uF  C-EU025-024X044  [C025-024X044]
IC95  74HC08N  [DIL14]
IC96  74HC00N  [DIL14]
IC97  74HC32N  [DIL14]
IC98  74HC112N  [DIL16]

### Nets
!CLL: IC95.10(C:I1) ; also sheet 4,5,6
!CPL: IC96.2(A:I1) ; also sheet 4,5,6
!DECCPL: IC96.9(C:I0) ; also sheet 16
!FLTADD: IC96.1(A:I0) ; also sheet 19
!INCCPL: IC96.10(C:I1) ; also sheet 16
!LCLR: IC95.8(C:O) IC98.15(A:CLR)
!RESET: IC95.9(C:I0) ; also sheet 2,3,4,7,8,10,11,12,13,14,18,19,20,21,22,25,26,28,29,30,31,44,45,46,47
CLK3: IC98.1(A:CLK) ; also sheet 2,3,7,19,44,45,46
FL: IC98.5(A:Q) ; also sheet 4,6,8,19,20
GND [low power]: C102.1 C103.1 C104.1 C105.1 C106.2 IC97.9(C:I0) IC97.10(C:I1) IC97.12(D:I0) IC97.13(D:I1) IC98.11(B:J) IC98.12(B:K) IC98.13(B:CLK) IC98.14(B:CLR) ; also sheet 2,3,4,5,6,7,8,9,10,11,12,13,14,15,16,18,19,20,21,22,24,25,26,27,28,29,30,31,32,33,34,35,36,37,38,39,40,41,42,43,44,45,46,47,48,49
ISROLL: IC95.1(A:I0) IC95.4(B:I0) ; also sheet 20
J: IC97.3(A:O) IC98.3(A:J)
K: IC97.6(B:O) IC98.2(A:K)
LJ: IC95.3(A:O) IC97.2(A:I1)
LK: IC95.6(B:O) IC97.5(B:I1)
LTOGGLE: IC96.11(D:O) IC97.1(A:I0) IC97.4(B:I0)
N$13: IC96.3(A:O) IC96.13(D:I1)
N$14: IC96.8(C:O) IC96.12(D:I0)
N$98: IC95.5(B:I1) IC96.6(B:O)
ROLL16: IC95.2(A:I1) IC96.4(B:I0) ; also sheet 20
VCC [low power]: C102.2 C103.2 C104.2 C105.2 C106.1 IC96.5(B:I1) IC98.4(A:PRE) IC98.10(B:PRE) ; also sheet 2,3,4,6,7,8,9,10,11,12,13,14,15,16,18,19,20,21,22,24,25,26,27,28,29,30,31,34,35,36,37,38,39,40,41,42,43,44,45,46,47,48,49
Unconnected: IC97.8(C:O) IC97.11(D:O) IC98.6(A:!Q) IC98.7(B:!Q) IC98.9(B:Q)

### Notes on the sheet
- Notes
- Clock is the falling edge of CLK5 (the 'write' clock), so all inputs have had time to settle.
- Since !FLTADD! is registered on the rising edge of CLK5, this implies that
- ADD carry out will toggle L one clock period after the addition itself.
- Clear sources (asynchronous):
- !CLL! resets it (L=0)
- !RESET! resets it. (L=0)
- Data out from a roll instruction sets the L register explicitly when L_LATCH is high.
- Toggle Sources (synchronous, to avoid glitches):
- ALU carry out (FLD)
- !CPL! toggles it (L=!L!)
- L Register (D flip flop with toggle and reset)
- Clears when !CLL or !RESET asserted.
- TODO:
- Decoupling | * DRC
- NC
- U

## Sheet 18 of 49
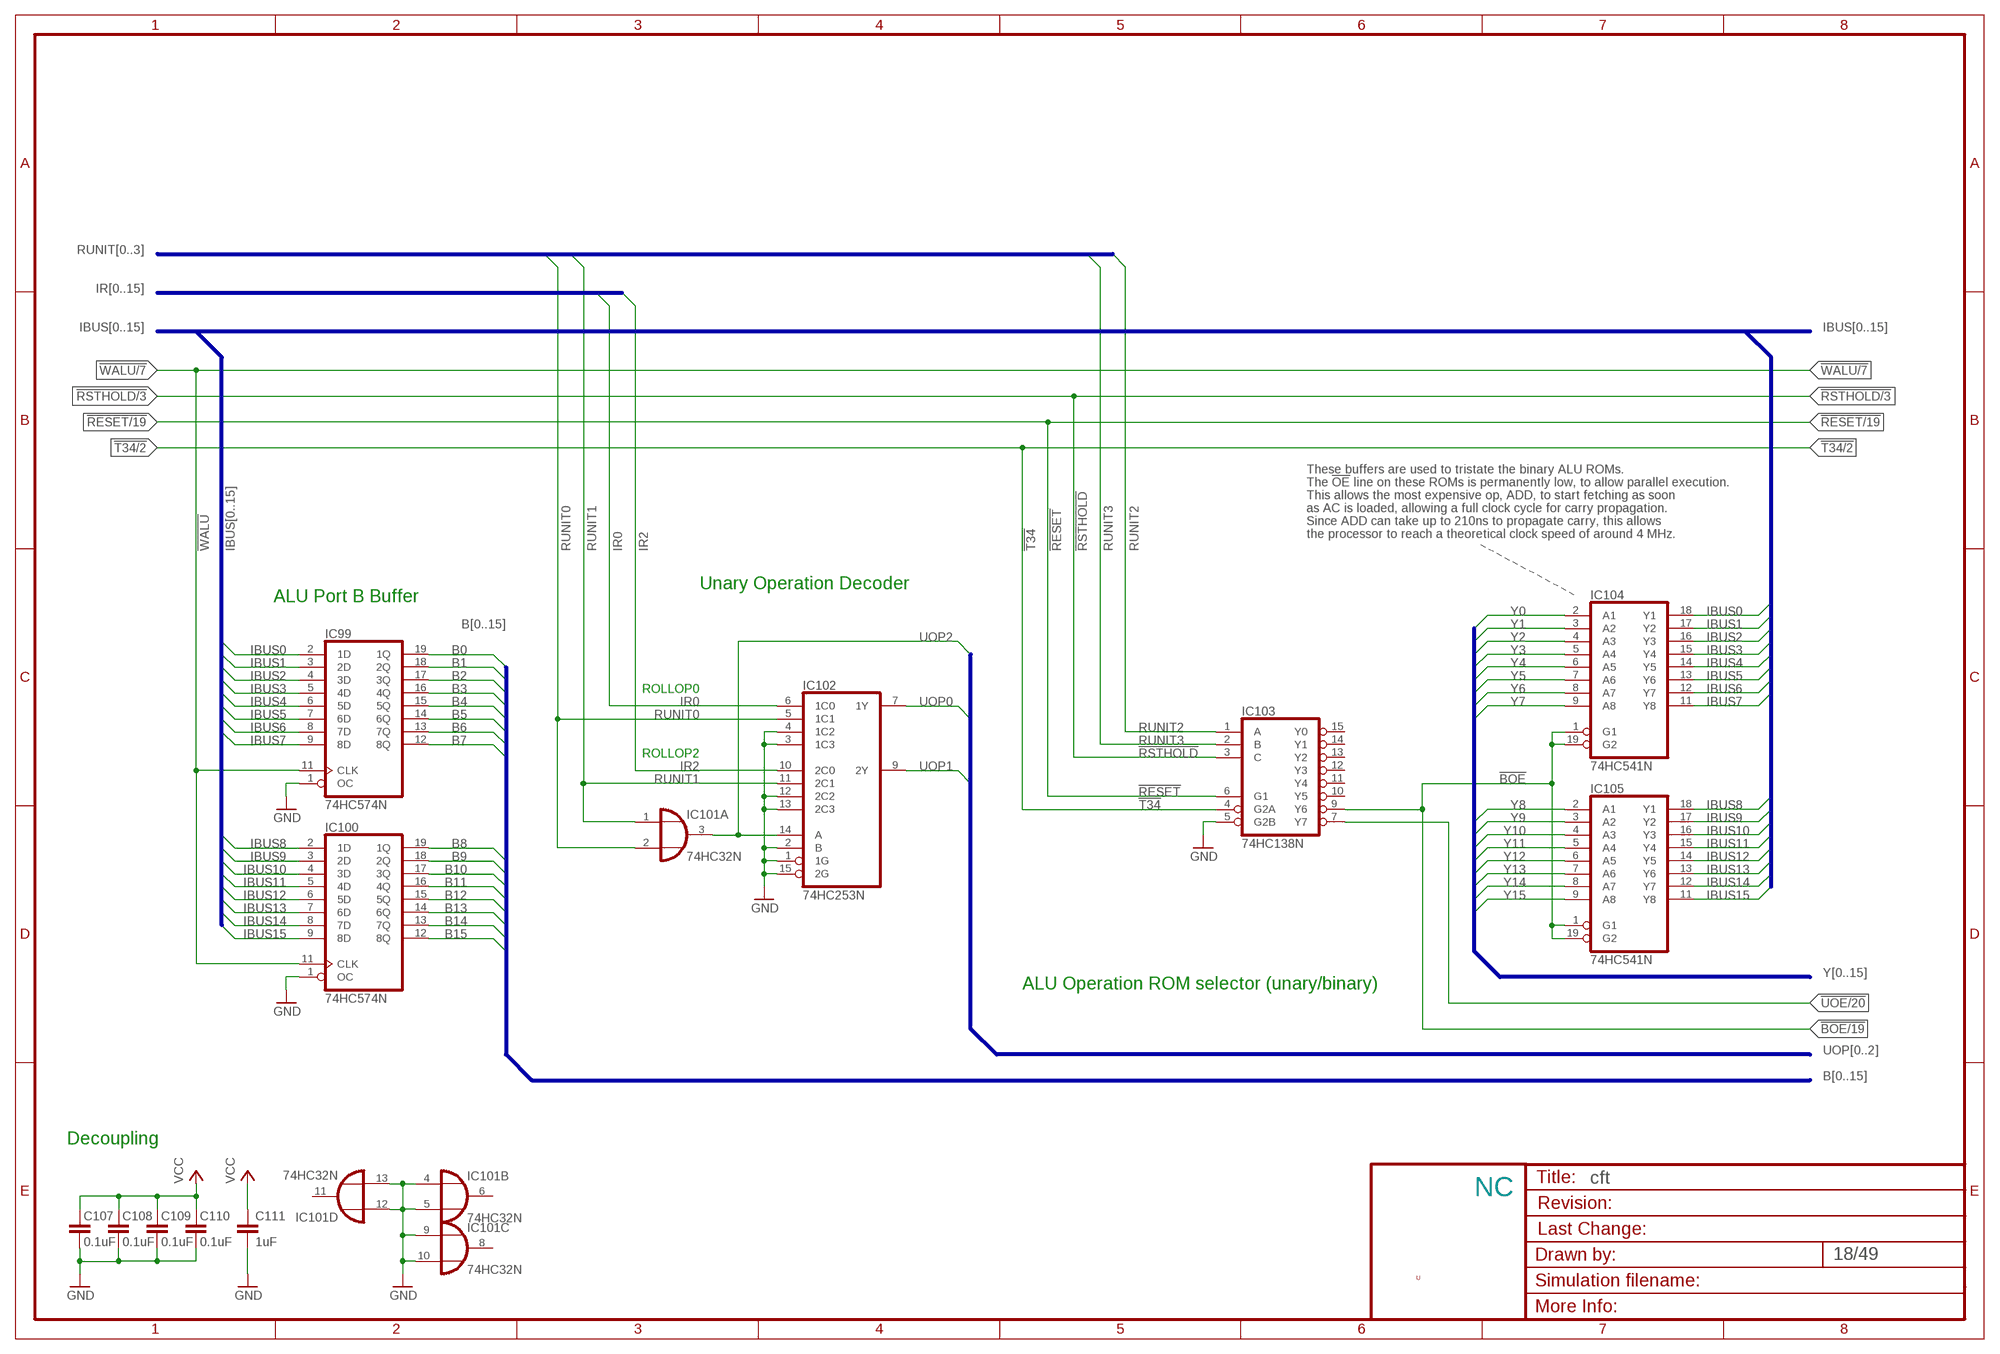
[diagram p17: schematic, sheet 18]

### Parts
C107  0.1uF  C-EU025-024X044  [C025-024X044]
C108  0.1uF  C-EU025-024X044  [C025-024X044]
C109  0.1uF  C-EU025-024X044  [C025-024X044]
C110  0.1uF  C-EU025-024X044  [C025-024X044]
C111  1uF  C-EU025-024X044  [C025-024X044]
IC99  74HC574N  [DIL20]
IC100  74HC574N  [DIL20]
IC101  74HC32N  [DIL14]
IC102  74HC253N  [DIL16]
IC103  74HC138N  [DIL16]
IC104  74HC541N  [DIL20]
IC105  74HC541N  [DIL20]

### Nets
!BOE: IC103.9(Y6) IC104.1(G1) IC104.19(G2) IC105.1(G1) IC105.19(G2) ; also sheet 19
!RESET: IC103.6(G1) ; also sheet 2,3,4,7,8,10,11,12,13,14,17,19,20,21,22,25,26,28,29,30,31,44,45,46,47
!RSTHOLD: IC103.3(C) ; also sheet 3,4,6
!T34: IC103.4(G2A) ; also sheet 2,12,44,45,46
!UOE: IC103.7(Y7) ; also sheet 20
!WALU: IC99.11(CLK) IC100.11(CLK) ; also sheet 6,7
B0: IC99.19(1Q) ; also sheet 19
B1: IC99.18(2Q) ; also sheet 19
B2: IC99.17(3Q) ; also sheet 19
B3: IC99.16(4Q) ; also sheet 19
B4: IC99.15(5Q) ; also sheet 19
B5: IC99.14(6Q) ; also sheet 19
B6: IC99.13(7Q) ; also sheet 19
B7: IC99.12(8Q) ; also sheet 19
B8: IC100.19(1Q) ; also sheet 19
B9: IC100.18(2Q) ; also sheet 19
B10: IC100.17(3Q) ; also sheet 19
B11: IC100.16(4Q) ; also sheet 19
B12: IC100.15(5Q) ; also sheet 19
B13: IC100.14(6Q) ; also sheet 19
B14: IC100.13(7Q) ; also sheet 19
B15: IC100.12(8Q) ; also sheet 19
GND [low power]: C107.1 C108.1 C109.1 C110.1 C111.2 IC99.1(OC) IC100.1(OC) IC101.4(B:I0) IC101.5(B:I1) IC101.9(C:I0) IC101.10(C:I1) IC101.12(D:I0) IC101.13(D:I1) IC102.1(1G) IC102.2(B) IC102.3(1C3) IC102.4(1C2) IC102.12(2C2) IC102.13(2C3) IC102.15(2G) IC103.5(G2B) ; also sheet 2,3,4,5,6,7,8,9,10,11,12,13,14,15,16,17,19,20,21,22,24,25,26,27,28,29,30,31,32,33,34,35,36,37,38,39,40,41,42,43,44,45,46,47,48,49
IBUS0: IC99.2(1D) IC104.18(Y1) ; also sheet 3,6,9,10,12,13,14,15,16,20
IBUS1: IC99.3(2D) IC104.17(Y2) ; also sheet 3,6,9,10,12,13,14,15,16,20
IBUS2: IC99.4(3D) IC104.16(Y3) ; also sheet 3,6,9,10,12,13,14,15,16,20
IBUS3: IC99.5(4D) IC104.15(Y4) ; also sheet 3,6,9,10,12,13,14,15,16,20
IBUS4: IC99.6(5D) IC104.14(Y5) ; also sheet 3,6,9,10,12,13,14,15,16,20
IBUS5: IC99.7(6D) IC104.13(Y6) ; also sheet 3,6,9,10,12,13,14,15,16,20
IBUS6: IC99.8(7D) IC104.12(Y7) ; also sheet 3,6,9,10,12,13,14,15,16,20
IBUS7: IC99.9(8D) IC104.11(Y8) ; also sheet 3,6,9,10,12,13,14,15,16,20
IBUS8: IC100.2(1D) IC105.18(Y1) ; also sheet 3,6,9,10,12,13,14,15,16,20
IBUS9: IC100.3(2D) IC105.17(Y2) ; also sheet 3,6,9,10,12,13,14,15,16,20
IBUS10: IC100.4(3D) IC105.16(Y3) ; also sheet 3,6,9,10,12,13,14,15,16,20
IBUS11: IC100.5(4D) IC105.15(Y4) ; also sheet 3,6,9,10,12,13,14,15,16,20
IBUS12: IC100.6(5D) IC105.14(Y5) ; also sheet 3,6,9,10,12,13,14,15,16,20
IBUS13: IC100.7(6D) IC105.13(Y6) ; also sheet 3,6,9,10,12,13,14,15,16,20
IBUS14: IC100.8(7D) IC105.12(Y7) ; also sheet 3,6,9,10,12,13,14,15,16,20
IBUS15: IC100.9(8D) IC105.11(Y8) ; also sheet 3,6,9,10,12,13,14,15,16,20
IR0: IC102.6(1C0) ; also sheet 6,8,9,10,32
IR2: IC102.10(2C0) ; also sheet 6,8,9,10,32
RUNIT0: IC101.2(A:I1) IC102.5(1C1) ; also sheet 4,5,6,7,19
RUNIT1: IC101.1(A:I0) IC102.11(2C1) ; also sheet 4,5,6,7,19
RUNIT2: IC103.1(A) ; also sheet 4,5,6,7
RUNIT3: IC103.2(B) ; also sheet 4,5,6,7
UOP0: IC102.7(1Y) ; also sheet 20
UOP1: IC102.9(2Y) ; also sheet 20
UOP2: IC101.3(A:O) IC102.14(A) ; also sheet 20
VCC [low power]: C107.2 C108.2 C109.2 C110.2 C111.1 ; also sheet 2,3,4,6,7,8,9,10,11,12,13,14,15,16,17,19,20,21,22,24,25,26,27,28,29,30,31,34,35,36,37,38,39,40,41,42,43,44,45,46,47,48,49
Y0: IC104.2(A1) ; also sheet 19
Y1: IC104.3(A2) ; also sheet 19
Y2: IC104.4(A3) ; also sheet 19
Y3: IC104.5(A4) ; also sheet 19
Y4: IC104.6(A5) ; also sheet 19
Y5: IC104.7(A6) ; also sheet 19
Y6: IC104.8(A7) ; also sheet 19
Y7: IC104.9(A8) ; also sheet 19
Y8: IC105.2(A1) ; also sheet 19
Y9: IC105.3(A2) ; also sheet 19
Y10: IC105.4(A3) ; also sheet 19
Y11: IC105.5(A4) ; also sheet 19
Y12: IC105.6(A5) ; also sheet 19
Y13: IC105.7(A6) ; also sheet 19
Y14: IC105.8(A7) ; also sheet 19
Y15: IC105.9(A8) ; also sheet 19
Unconnected: IC101.6(B:O) IC101.8(C:O) IC101.11(D:O) IC103.10(Y5) IC103.11(Y4) IC103.12(Y3) IC103.13(Y2) IC103.14(Y1) IC103.15(Y0)

### Buses
IBUS[0..15]
B[0..15]
UOP[0..2]
IR[0..15]
RUNIT[0..3]
Y[0..15]

### Notes on the sheet
- These buffers are used to tristate the binary ALU ROMs.
- The !OE! line on these ROMs is permanently low, to allow parallel execution.
- This allows the most expensive op, ADD, to start fetching as soon
- as AC is loaded, allowing a full clock cycle for carry propagation.
- Since ADD can take up to 210ns to propagate carry, this allows
- the processor to reach a theoretical clock speed of around 4 MHz.
- Unary Operation Decoder
- ALU Port B Buffer
- ROLLOP0
- ROLLOP2
- ALU Operation ROM selector (unary/binary)
- Decoupling
- NC
- U

## Sheet 19 of 49
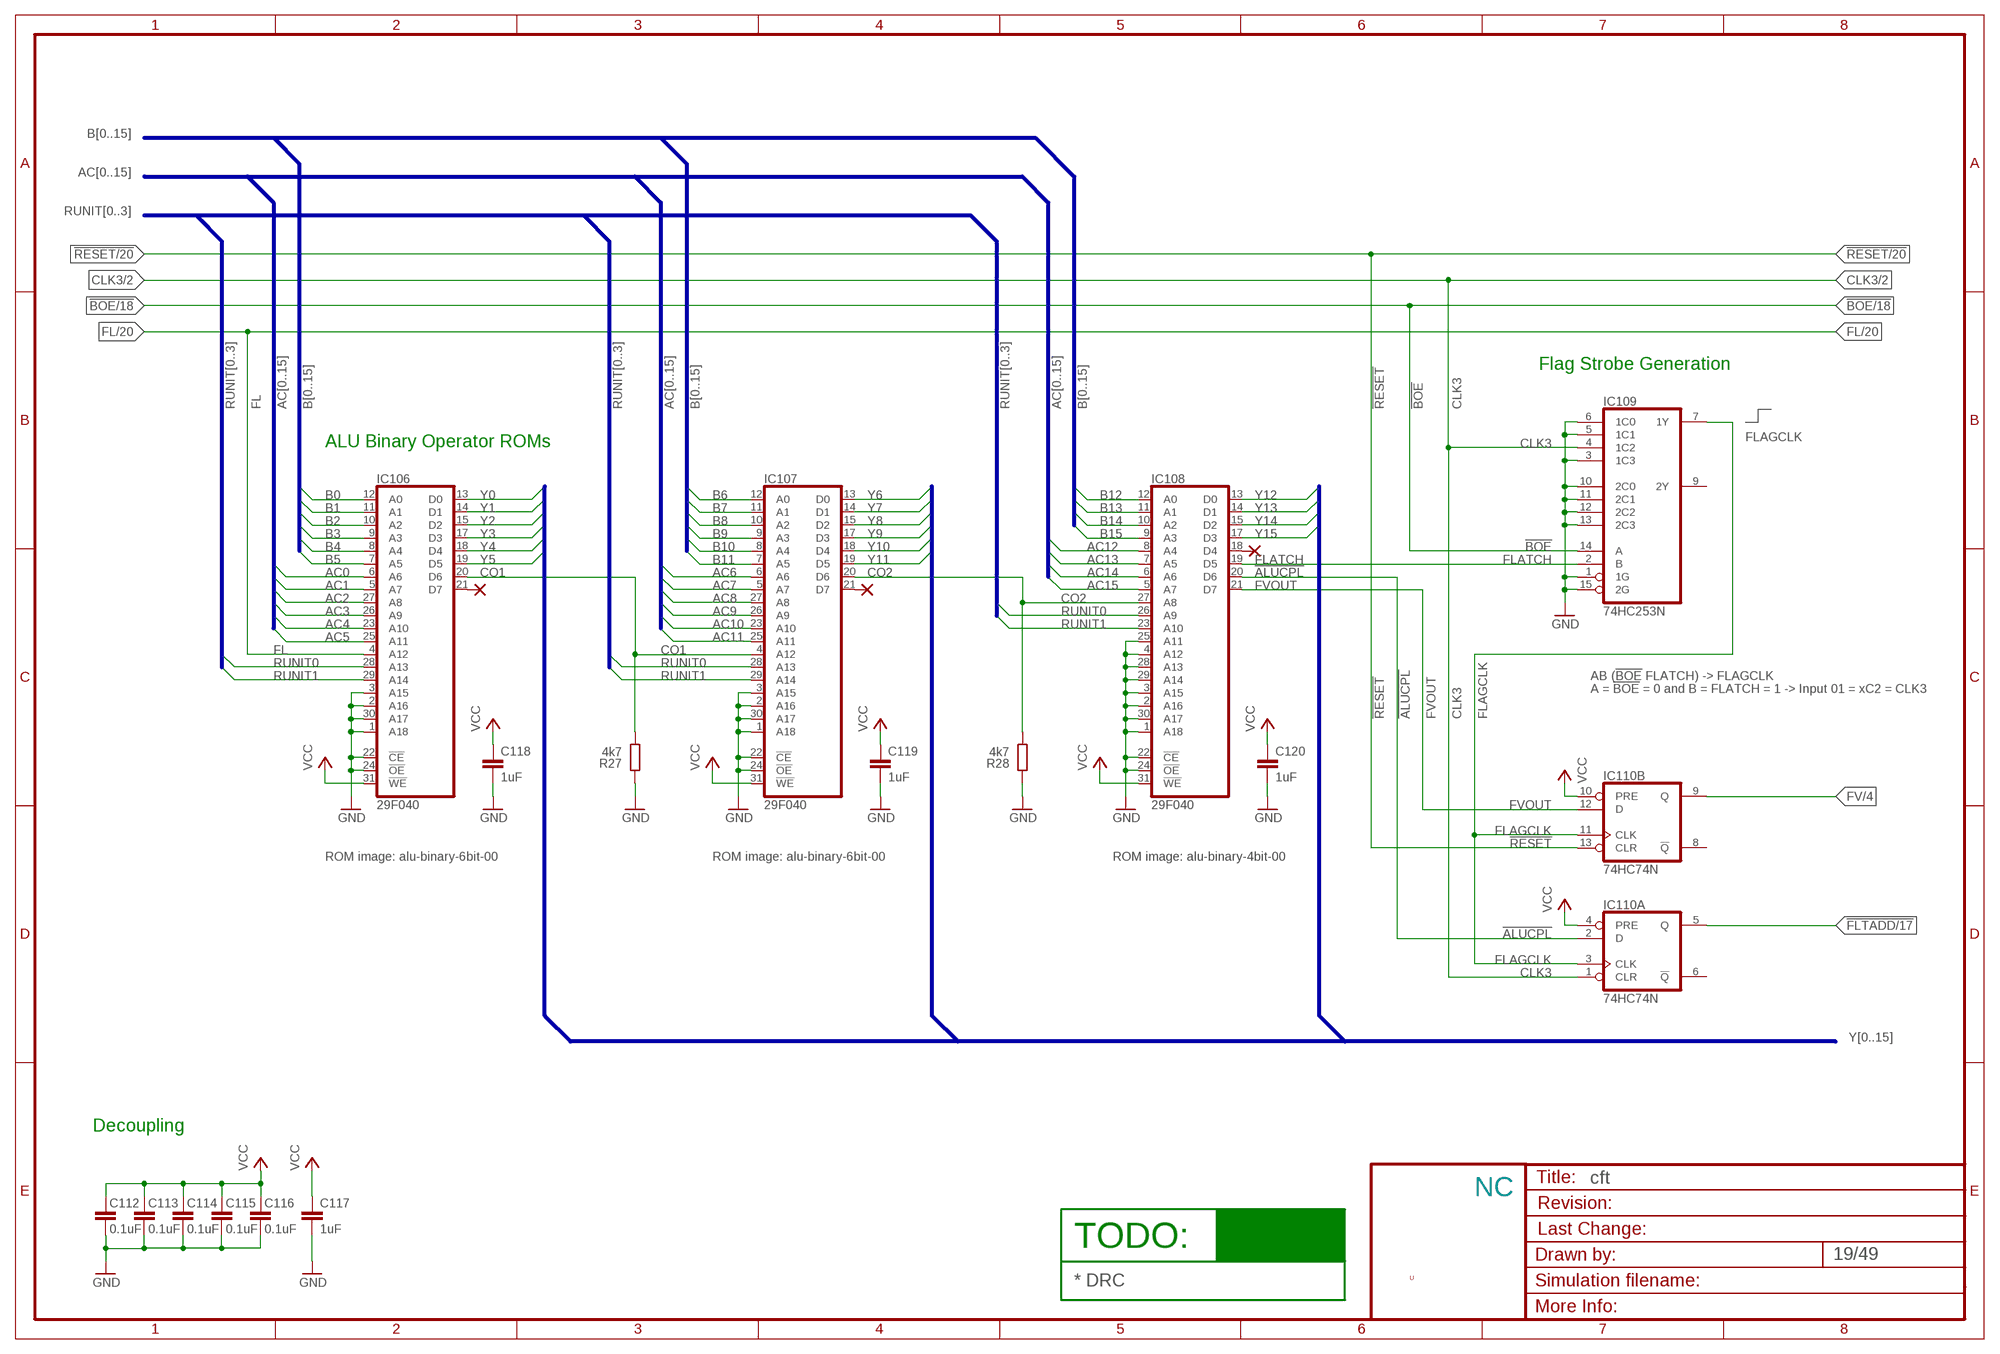
[diagram p18: schematic, sheet 19]

### Parts
C112  0.1uF  C-EU025-024X044  [C025-024X044]
C113  0.1uF  C-EU025-024X044  [C025-024X044]
C114  0.1uF  C-EU025-024X044  [C025-024X044]
C115  0.1uF  C-EU025-024X044  [C025-024X044]
C116  0.1uF  C-EU025-024X044  [C025-024X044]
C117  1uF  C-EU025-024X044  [C025-024X044]
C118  1uF  C-EU025-024X044  [C025-024X044]
C119  1uF  C-EU025-024X044  [C025-024X044]
C120  1uF  C-EU025-024X044  [C025-024X044]
IC106  29F040  29F040PLCC32  [PLCC32]
IC107  29F040  29F040PLCC32  [PLCC32]
IC108  29F040  29F040PLCC32  [PLCC32]
IC109  74HC253N  [DIL16]
IC110  74HC74N  [DIL14]
PAD6  1,6/0,8  [1,6/0,8]
PAD7  1,6/0,8  [1,6/0,8]
PAD8  1,6/0,8  [1,6/0,8]
R27  4k7  R-EU_0204/7  [0204/7]
R28  4k7  R-EU_0204/7  [0204/7]

### Nets
!ALUCPL: IC108.20(D6) IC110.2(A:D)
!BOE: IC109.14(A) ; also sheet 18
!FLTADD: IC110.5(A:Q) ; also sheet 17
!RESET: IC110.13(B:CLR) ; also sheet 2,3,4,7,8,10,11,12,13,14,17,18,20,21,22,25,26,28,29,30,31,44,45,46,47
AC0: IC106.6(A6) ; also sheet 16,20,32
AC1: IC106.5(A7) ; also sheet 16,20,32
AC2: IC106.27(A8) ; also sheet 16,20,32
AC3: IC106.26(A9) ; also sheet 16,20,32
AC4: IC106.23(A10) ; also sheet 16,20,32
AC5: IC106.25(A11) ; also sheet 16,20,32
AC6: IC107.6(A6) ; also sheet 16,20,32
AC7: IC107.5(A7) ; also sheet 16,20,32
AC8: IC107.27(A8) ; also sheet 16,20,32
AC9: IC107.26(A9) ; also sheet 16,20,32
AC10: IC107.23(A10) ; also sheet 16,20,32
AC11: IC107.25(A11) ; also sheet 16,20,32
B0: IC106.12(A0) ; also sheet 18
B1: IC106.11(A1) ; also sheet 18
B2: IC106.10(A2) ; also sheet 18
B3: IC106.9(A3) ; also sheet 18
B4: IC106.8(A4) ; also sheet 18
B5: IC106.7(A5) ; also sheet 18
B6: IC107.12(A0) ; also sheet 18
B7: IC107.11(A1) ; also sheet 18
B8: IC107.10(A2) ; also sheet 18
B9: IC107.9(A3) ; also sheet 18
B10: IC107.8(A4) ; also sheet 18
B11: IC107.7(A5) ; also sheet 18
B12: IC108.12(A0) ; also sheet 18
B13: IC108.11(A1) ; also sheet 18
B14: IC108.10(A2) ; also sheet 18
B15: IC108.9(A3) ; also sheet 18
CLK3: IC109.4(1C2) IC110.1(A:CLR) ; also sheet 2,3,7,17,44,45,46
CO1: IC106.20(D6) IC107.4(A12) R27.1
CO2: IC107.20(D6) R28.1
FL: IC106.4(A12) ; also sheet 4,6,8,17,20
FLAGCLK: IC109.7(1Y) IC110.3(A:CLK) IC110.11(B:CLK)
FLATCH: IC108.19(D5) IC109.2(B)
FV: IC110.9(B:Q) ; also sheet 4,6,8
FVOUT: IC108.21(D7) IC110.12(B:D)
GND [low power]: C112.1 C113.1 C114.1 C115.1 C116.1 C117.2 C118.2 C119.2 C120.2 IC106.1(A18) IC106.2(A16) IC106.3(A15) IC106.22(!CE) IC106.24(!OE) IC106.30(A17) IC107.1(A18) IC107.2(A16) IC107.3(A15) IC107.22(!CE) IC107.24(!OE) IC107.30(A17) IC108.1(A18) IC108.2(A16) IC108.3(A15) IC108.4(A12) IC108.22(!CE) IC108.24(!OE) IC108.25(A11) IC108.28(A13) IC108.29(A14) IC108.30(A17) IC109.1(1G) IC109.3(1C3) IC109.5(1C1) IC109.6(1C0) IC109.10(2C0) IC109.11(2C1) IC109.12(2C2) IC109.13(2C3) IC109.15(2G) R27.2 R28.2 ; also sheet 2,3,4,5,6,7,8,9,10,11,12,13,14,15,16,17,18,20,21,22,24,25,26,27,28,29,30,31,32,33,34,35,36,37,38,39,40,41,42,43,44,45,46,47,48,49
N$102: IC108.18(D4) PAD8.1(P)
N$103: IC107.21(D7) PAD7.1(P)
N$105: IC106.21(D7) PAD6.1(P)
RUNIT0: IC106.28(A13) IC107.28(A13) ; also sheet 4,5,6,7,18
RUNIT1: IC106.29(A14) IC107.29(A14) ; also sheet 4,5,6,7,18
VCC [low power]: C112.2 C113.2 C114.2 C115.2 C116.2 C117.1 C118.1 C119.1 C120.1 IC106.31(!WE) IC107.31(!WE) IC108.31(!WE) IC110.4(A:PRE) IC110.10(B:PRE) ; also sheet 2,3,4,6,7,8,9,10,11,12,13,14,15,16,17,18,20,21,22,24,25,26,27,28,29,30,31,34,35,36,37,38,39,40,41,42,43,44,45,46,47,48,49
Y0: IC106.13(D0) ; also sheet 18
Y1: IC106.14(D1) ; also sheet 18
Y2: IC106.15(D2) ; also sheet 18
Y3: IC106.17(D3) ; also sheet 18
Y4: IC106.18(D4) ; also sheet 18
Y5: IC106.19(D5) ; also sheet 18
Y6: IC107.13(D0) ; also sheet 18
Y7: IC107.14(D1) ; also sheet 18
Y8: IC107.15(D2) ; also sheet 18
Y9: IC107.17(D3) ; also sheet 18
Y10: IC107.18(D4) ; also sheet 18
Y11: IC107.19(D5) ; also sheet 18
Y12: IC108.13(D0) ; also sheet 18
Y13: IC108.14(D1) ; also sheet 18
Y14: IC108.15(D2) ; also sheet 18
Y15: IC108.17(D3) ; also sheet 18
Unconnected: IC108.5(A7) IC108.6(A6) IC108.7(A5) IC108.8(A4) IC108.23(A10) IC108.26(A9) IC108.27(A8) IC109.9(2Y) IC110.6(A:!Q) IC110.8(B:!Q)

### Buses
Y[0..15]
B[0..15]
AC[0..15]
RUNIT[0..3]

### Notes on the sheet
- Flag Strobe Generation
- ALU Binary Operator ROMs
- AB (!BOE! FLATCH) -> FLAGCLK
- A = !BOE! = 0 and B = FLATCH = 1 -> Input 01 = xC2 = CLK3
- ROM image: alu-binary-6bit-00 | ROM image: alu-binary-6bit-00 | ROM image: alu-binary-4bit-00
- Decoupling
- NC
- TODO:
- U
- * DRC

## Sheet 20 of 49
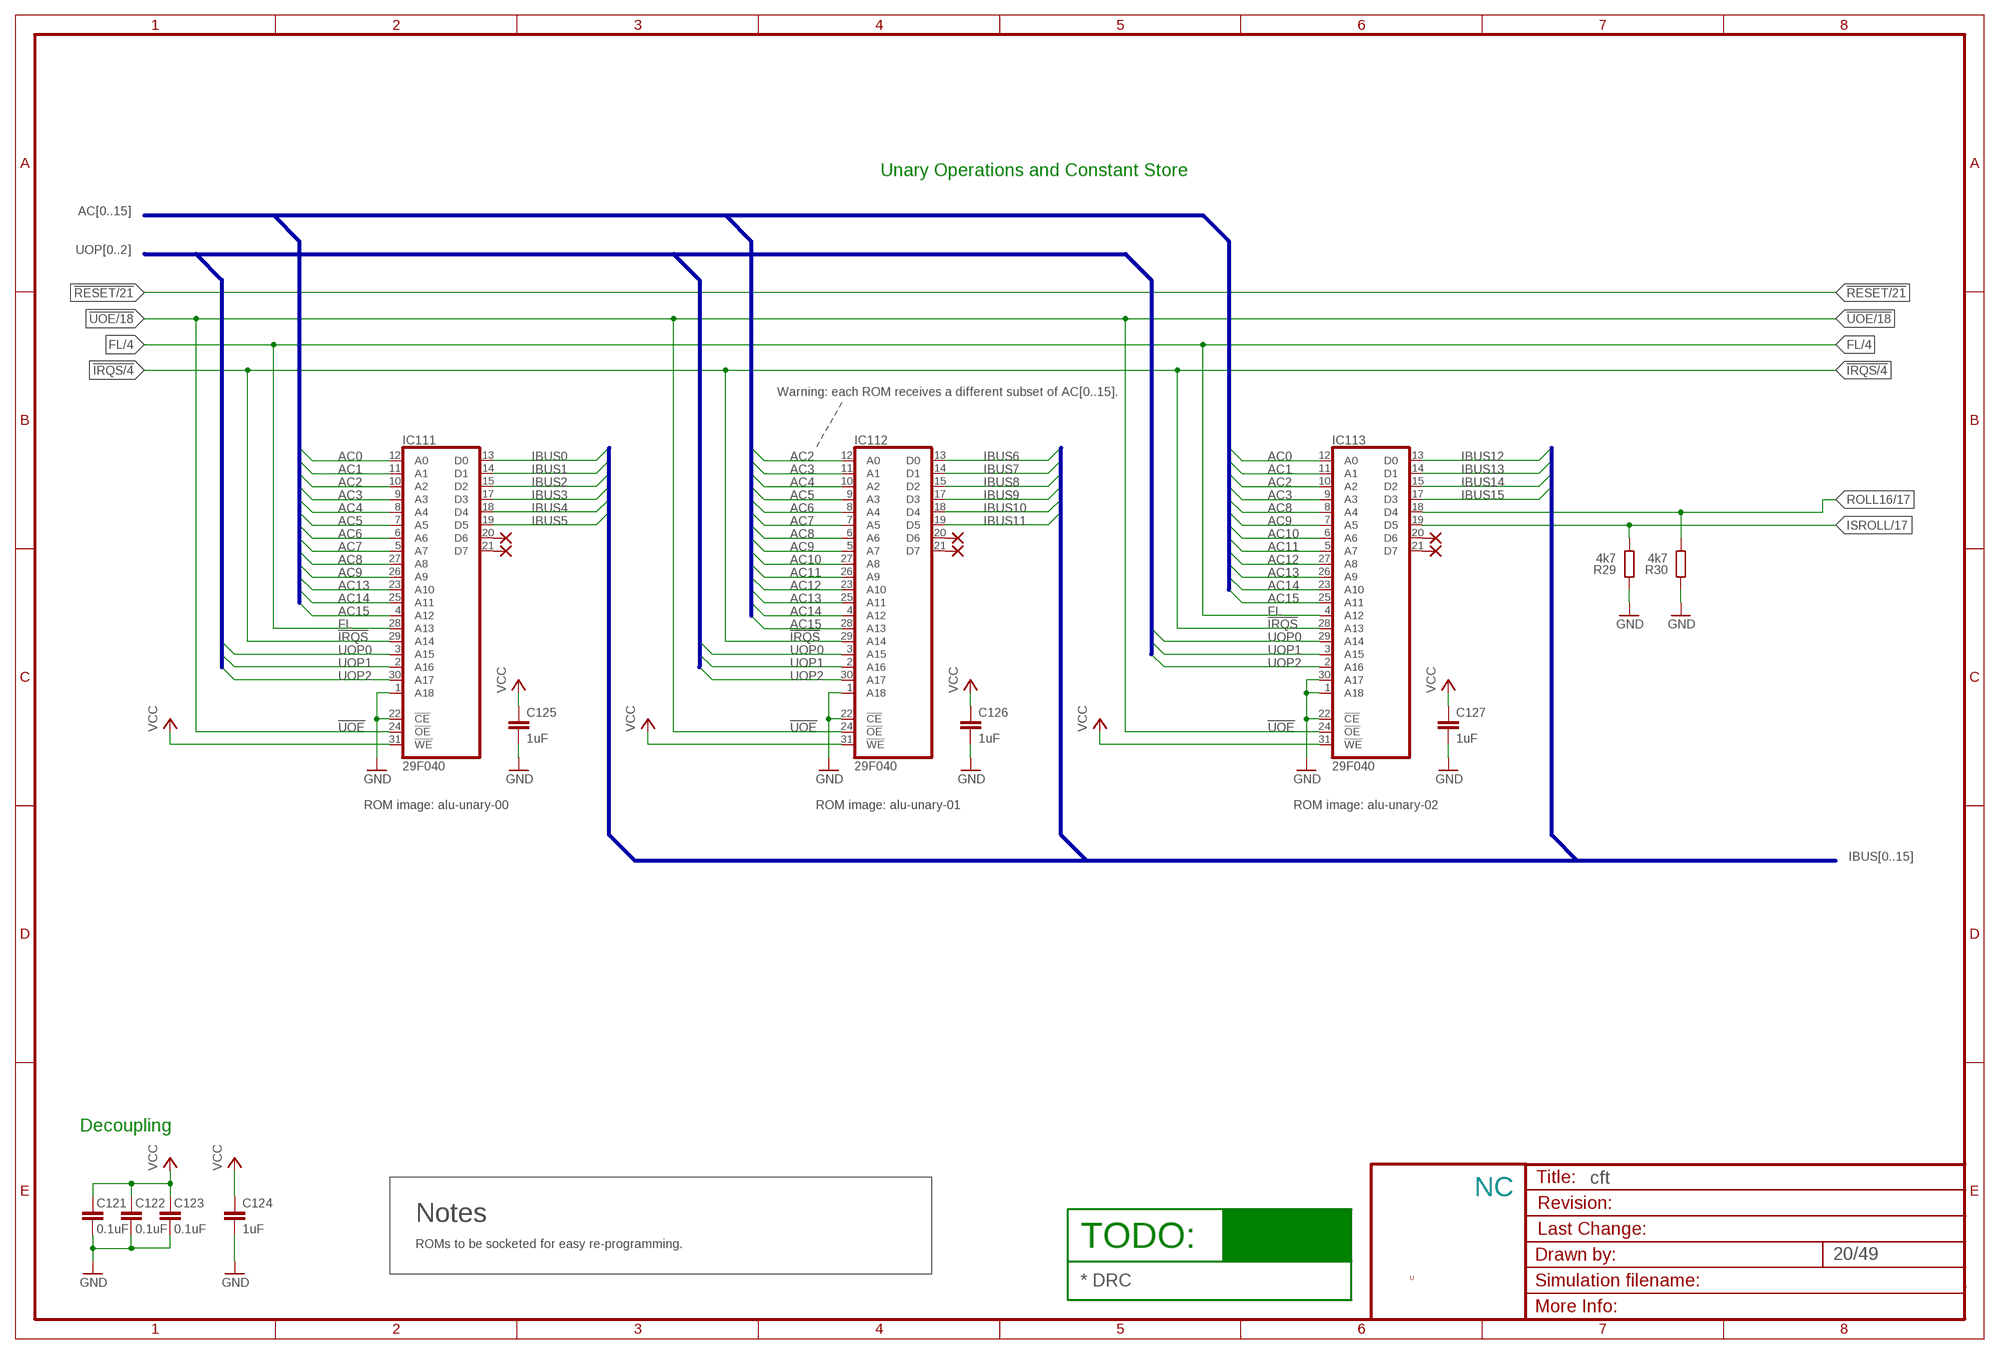
[diagram p19: schematic, sheet 20]

### Parts
C121  0.1uF  C-EU025-024X044  [C025-024X044]
C122  0.1uF  C-EU025-024X044  [C025-024X044]
C123  0.1uF  C-EU025-024X044  [C025-024X044]
C124  1uF  C-EU025-024X044  [C025-024X044]
C125  1uF  C-EU025-024X044  [C025-024X044]
C126  1uF  C-EU025-024X044  [C025-024X044]
C127  1uF  C-EU025-024X044  [C025-024X044]
IC111  29F040  29F040PLCC32  [PLCC32]
IC112  29F040  29F040PLCC32  [PLCC32]
IC113  29F040  29F040PLCC32  [PLCC32]
PAD9  1,6/0,8  [1,6/0,8]
PAD10  1,6/0,8  [1,6/0,8]
PAD11  1,6/0,8  [1,6/0,8]
PAD12  1,6/0,8  [1,6/0,8]
PAD13  1,6/0,8  [1,6/0,8]
PAD14  1,6/0,8  [1,6/0,8]
R29  4k7  R-EU_0204/7  [0204/7]
R30  4k7  R-EU_0204/7  [0204/7]

### Nets
!IRQS: IC111.29(A14) IC112.29(A14) IC113.28(A13) ; also sheet 4,6,11,40,44,45,46
!UOE: IC111.24(!OE) IC112.24(!OE) IC113.24(!OE) ; also sheet 18
AC0: IC111.12(A0) IC113.12(A0) ; also sheet 16,19,32
AC1: IC111.11(A1) IC113.11(A1) ; also sheet 16,19,32
AC2: IC111.10(A2) IC112.12(A0) IC113.10(A2) ; also sheet 16,19,32
AC3: IC111.9(A3) IC112.11(A1) IC113.9(A3) ; also sheet 16,19,32
AC4: IC111.8(A4) IC112.10(A2) ; also sheet 16,19,32
AC5: IC111.7(A5) IC112.9(A3) ; also sheet 16,19,32
AC6: IC111.6(A6) IC112.8(A4) ; also sheet 16,19,32
AC7: IC111.5(A7) IC112.7(A5) ; also sheet 16,19,32
AC8: IC111.27(A8) IC112.6(A6) IC113.8(A4) ; also sheet 16,19,32
AC9: IC111.26(A9) IC112.5(A7) IC113.7(A5) ; also sheet 16,19,32
AC10: IC112.27(A8) IC113.6(A6) ; also sheet 16,19,32
AC11: IC112.26(A9) IC113.5(A7) ; also sheet 16,19,32
AC12: IC112.23(A10) IC113.27(A8) ; also sheet 16,19,32
AC13: IC111.23(A10) IC112.25(A11) IC113.26(A9) ; also sheet 16,19,32
AC14: IC111.25(A11) IC112.4(A12) IC113.23(A10) ; also sheet 16,19,32
AC15: IC111.4(A12) IC112.28(A13) IC113.25(A11) ; also sheet 16,19,32
FL: IC111.28(A13) IC113.4(A12) ; also sheet 4,6,8,17,19
GND [low power]: C121.1 C122.1 C123.1 C124.2 C125.2 C126.2 C127.2 IC111.1(A18) IC111.22(!CE) IC112.1(A18) IC112.22(!CE) IC113.1(A18) IC113.22(!CE) IC113.30(A17) R29.2 R30.2 ; also sheet 2,3,4,5,6,7,8,9,10,11,12,13,14,15,16,17,18,19,21,22,24,25,26,27,28,29,30,31,32,33,34,35,36,37,38,39,40,41,42,43,44,45,46,47,48,49
IBUS0: IC111.13(D0) ; also sheet 3,6,9,10,12,13,14,15,16,18
IBUS1: IC111.14(D1) ; also sheet 3,6,9,10,12,13,14,15,16,18
IBUS2: IC111.15(D2) ; also sheet 3,6,9,10,12,13,14,15,16,18
IBUS3: IC111.17(D3) ; also sheet 3,6,9,10,12,13,14,15,16,18
IBUS4: IC111.18(D4) ; also sheet 3,6,9,10,12,13,14,15,16,18
IBUS5: IC111.19(D5) ; also sheet 3,6,9,10,12,13,14,15,16,18
IBUS6: IC112.13(D0) ; also sheet 3,6,9,10,12,13,14,15,16,18
IBUS7: IC112.14(D1) ; also sheet 3,6,9,10,12,13,14,15,16,18
IBUS8: IC112.15(D2) ; also sheet 3,6,9,10,12,13,14,15,16,18
IBUS9: IC112.17(D3) ; also sheet 3,6,9,10,12,13,14,15,16,18
IBUS10: IC112.18(D4) ; also sheet 3,6,9,10,12,13,14,15,16,18
IBUS11: IC112.19(D5) ; also sheet 3,6,9,10,12,13,14,15,16,18
IBUS12: IC113.13(D0) ; also sheet 3,6,9,10,12,13,14,15,16,18
IBUS13: IC113.14(D1) ; also sheet 3,6,9,10,12,13,14,15,16,18
IBUS14: IC113.15(D2) ; also sheet 3,6,9,10,12,13,14,15,16,18
IBUS15: IC113.17(D3) ; also sheet 3,6,9,10,12,13,14,15,16,18
ISROLL: IC113.19(D5) R29.1 ; also sheet 17
N$100: IC112.20(D6) PAD11.1(P)
N$101: IC112.21(D7) PAD12.1(P)
N$106: IC111.20(D6) PAD9.1(P)
N$107: IC111.21(D7) PAD10.1(P)
N$108: IC113.20(D6) PAD13.1(P)
N$109: IC113.21(D7) PAD14.1(P)
ROLL16: IC113.18(D4) R30.1 ; also sheet 17
UOP0: IC111.3(A15) IC112.3(A15) IC113.29(A14) ; also sheet 18
UOP1: IC111.2(A16) IC112.2(A16) IC113.3(A15) ; also sheet 18
UOP2: IC111.30(A17) IC112.30(A17) IC113.2(A16) ; also sheet 18
VCC [low power]: C121.2 C122.2 C123.2 C124.1 C125.1 C126.1 C127.1 IC111.31(!WE) IC112.31(!WE) IC113.31(!WE) ; also sheet 2,3,4,6,7,8,9,10,11,12,13,14,15,16,17,18,19,21,22,24,25,26,27,28,29,30,31,34,35,36,37,38,39,40,41,42,43,44,45,46,47,48,49

### Buses
AC[0..15]
UOP[0..2]
IBUS[0..15]
RUNIT[0..3]

### Notes on the sheet
- Unary Operations and Constant Store
- Warning: each ROM receives a different subset of AC[0..15].
- ROM image: alu-unary-00 | ROM image: alu-unary-01 | ROM image: alu-unary-02
- Decoupling
- NC
- Notes
- ROMs to be socketed for easy re-programming. | TODO:
- U
- * DRC